# EAGLE board MotorDriver (EAGLE 9.6.2), part 1 of 2
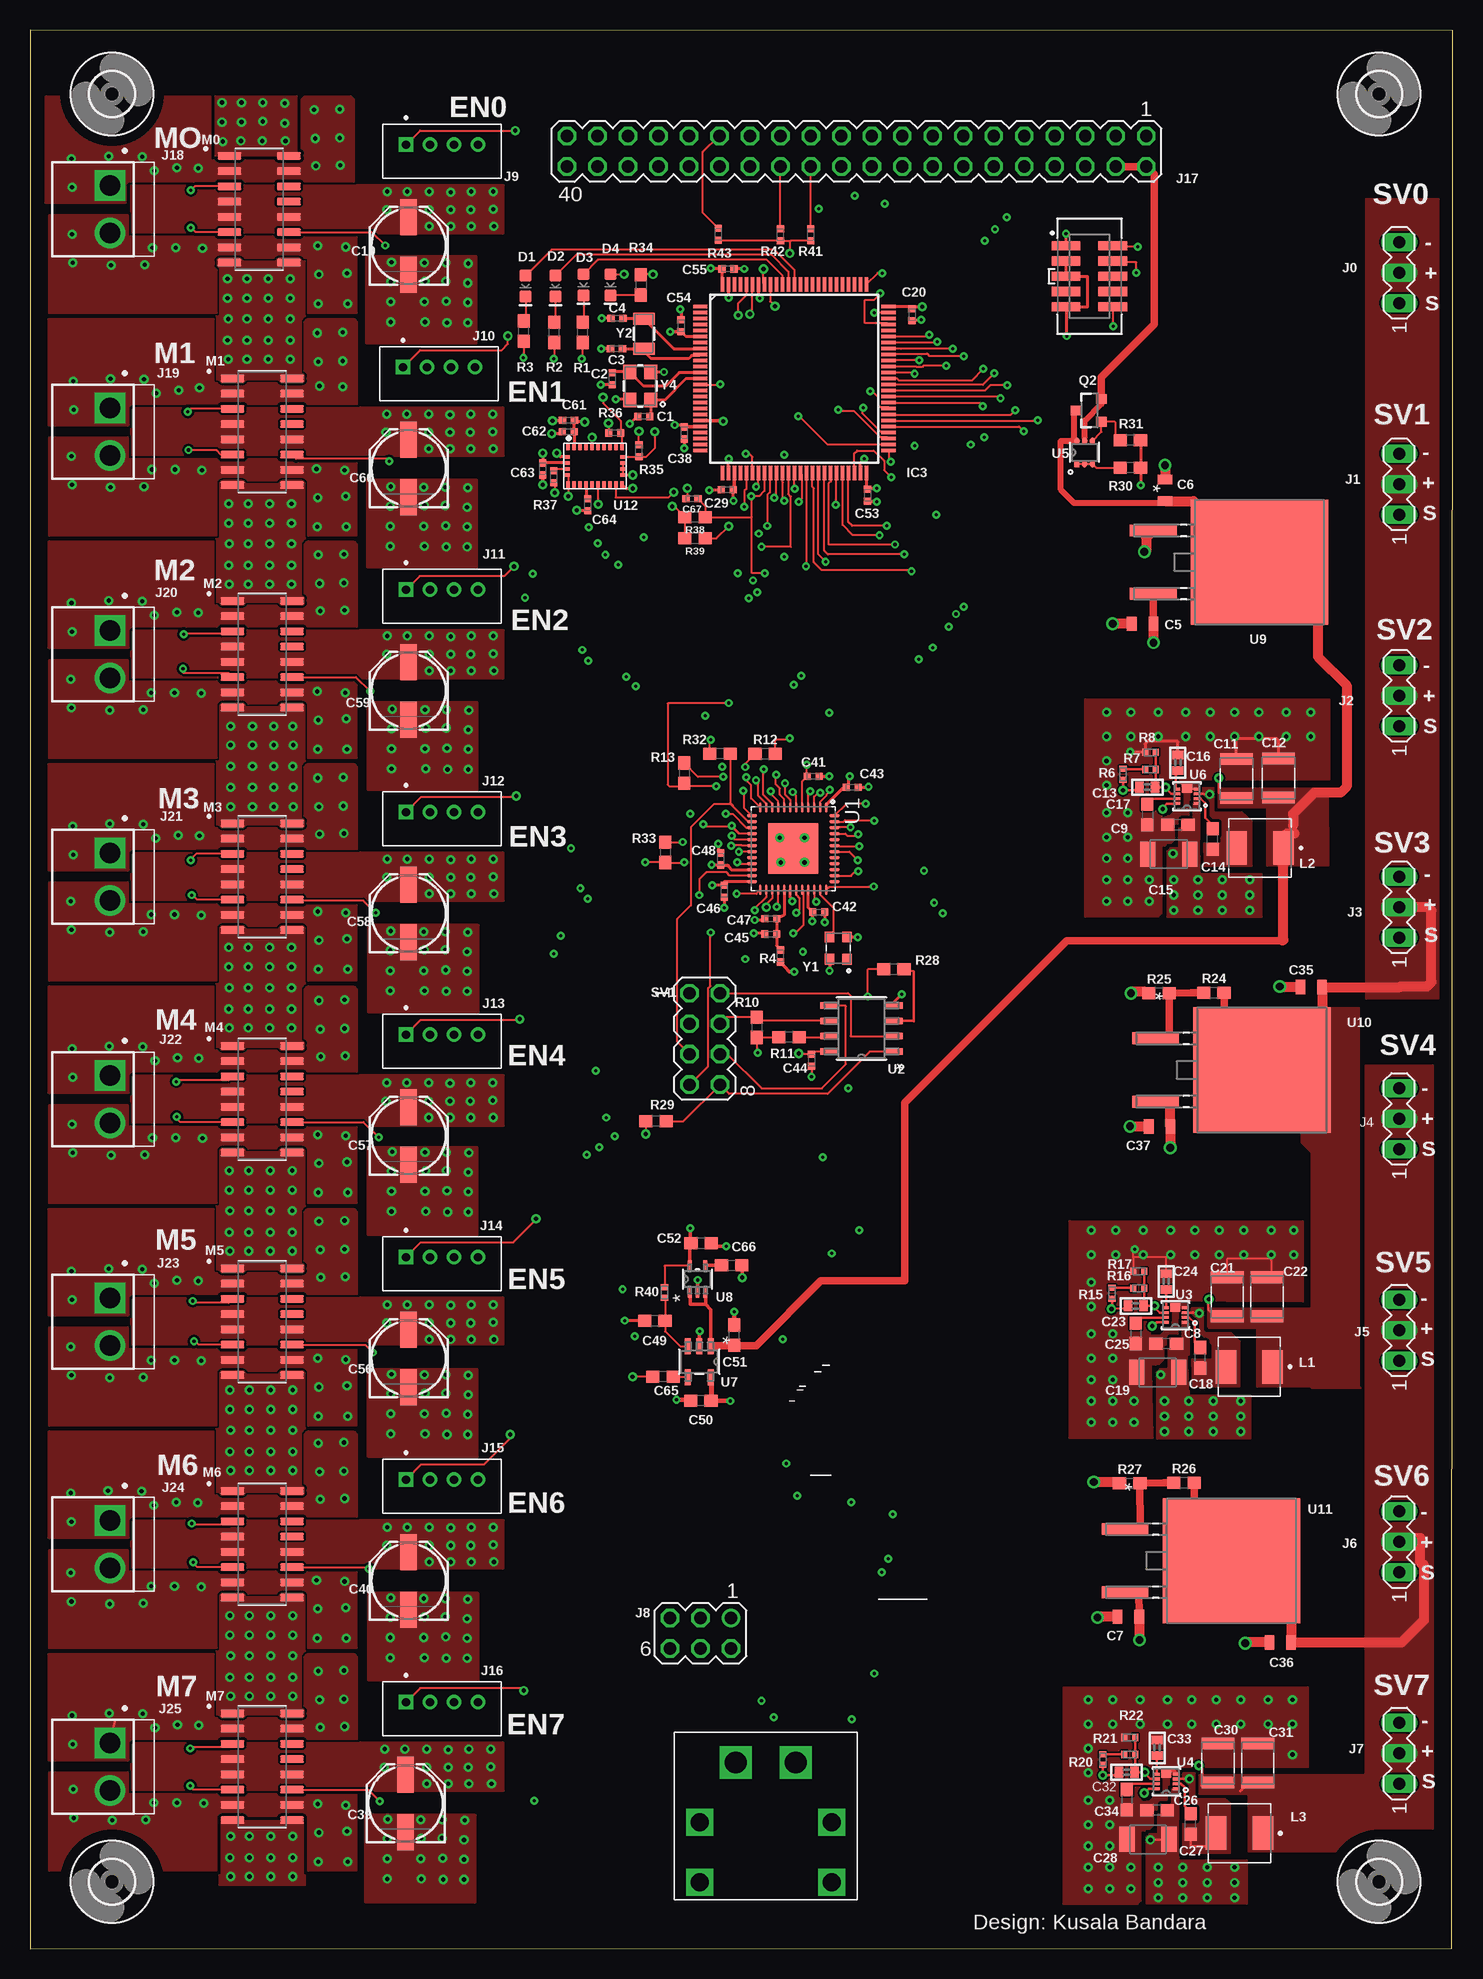
[diagram p5: board, top side]
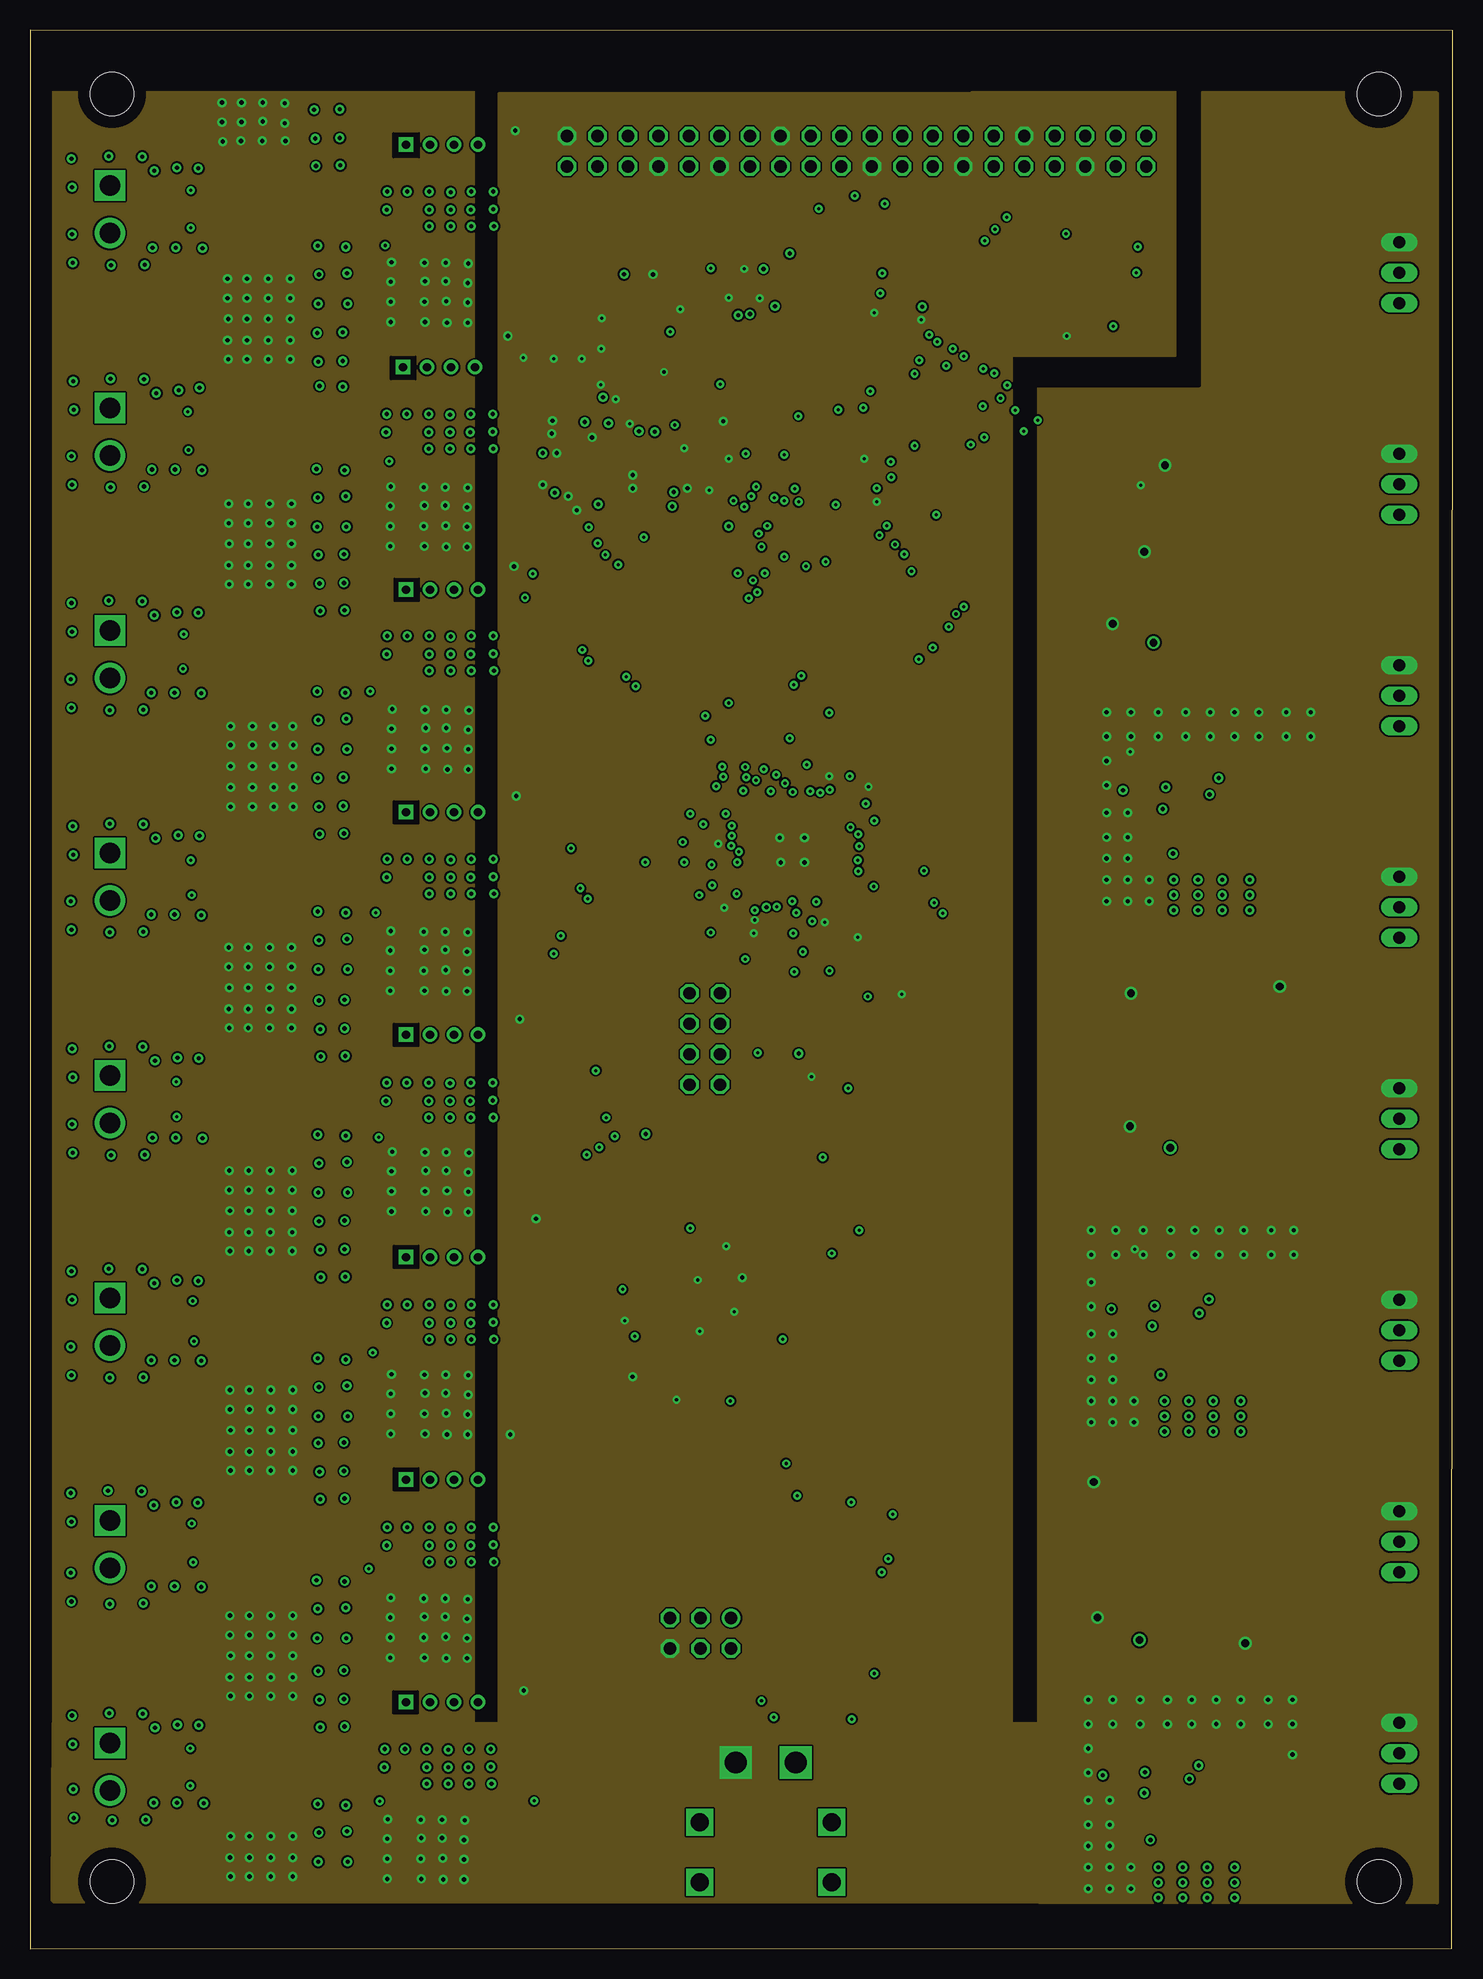
[diagram p6: board, inner layer Route2]
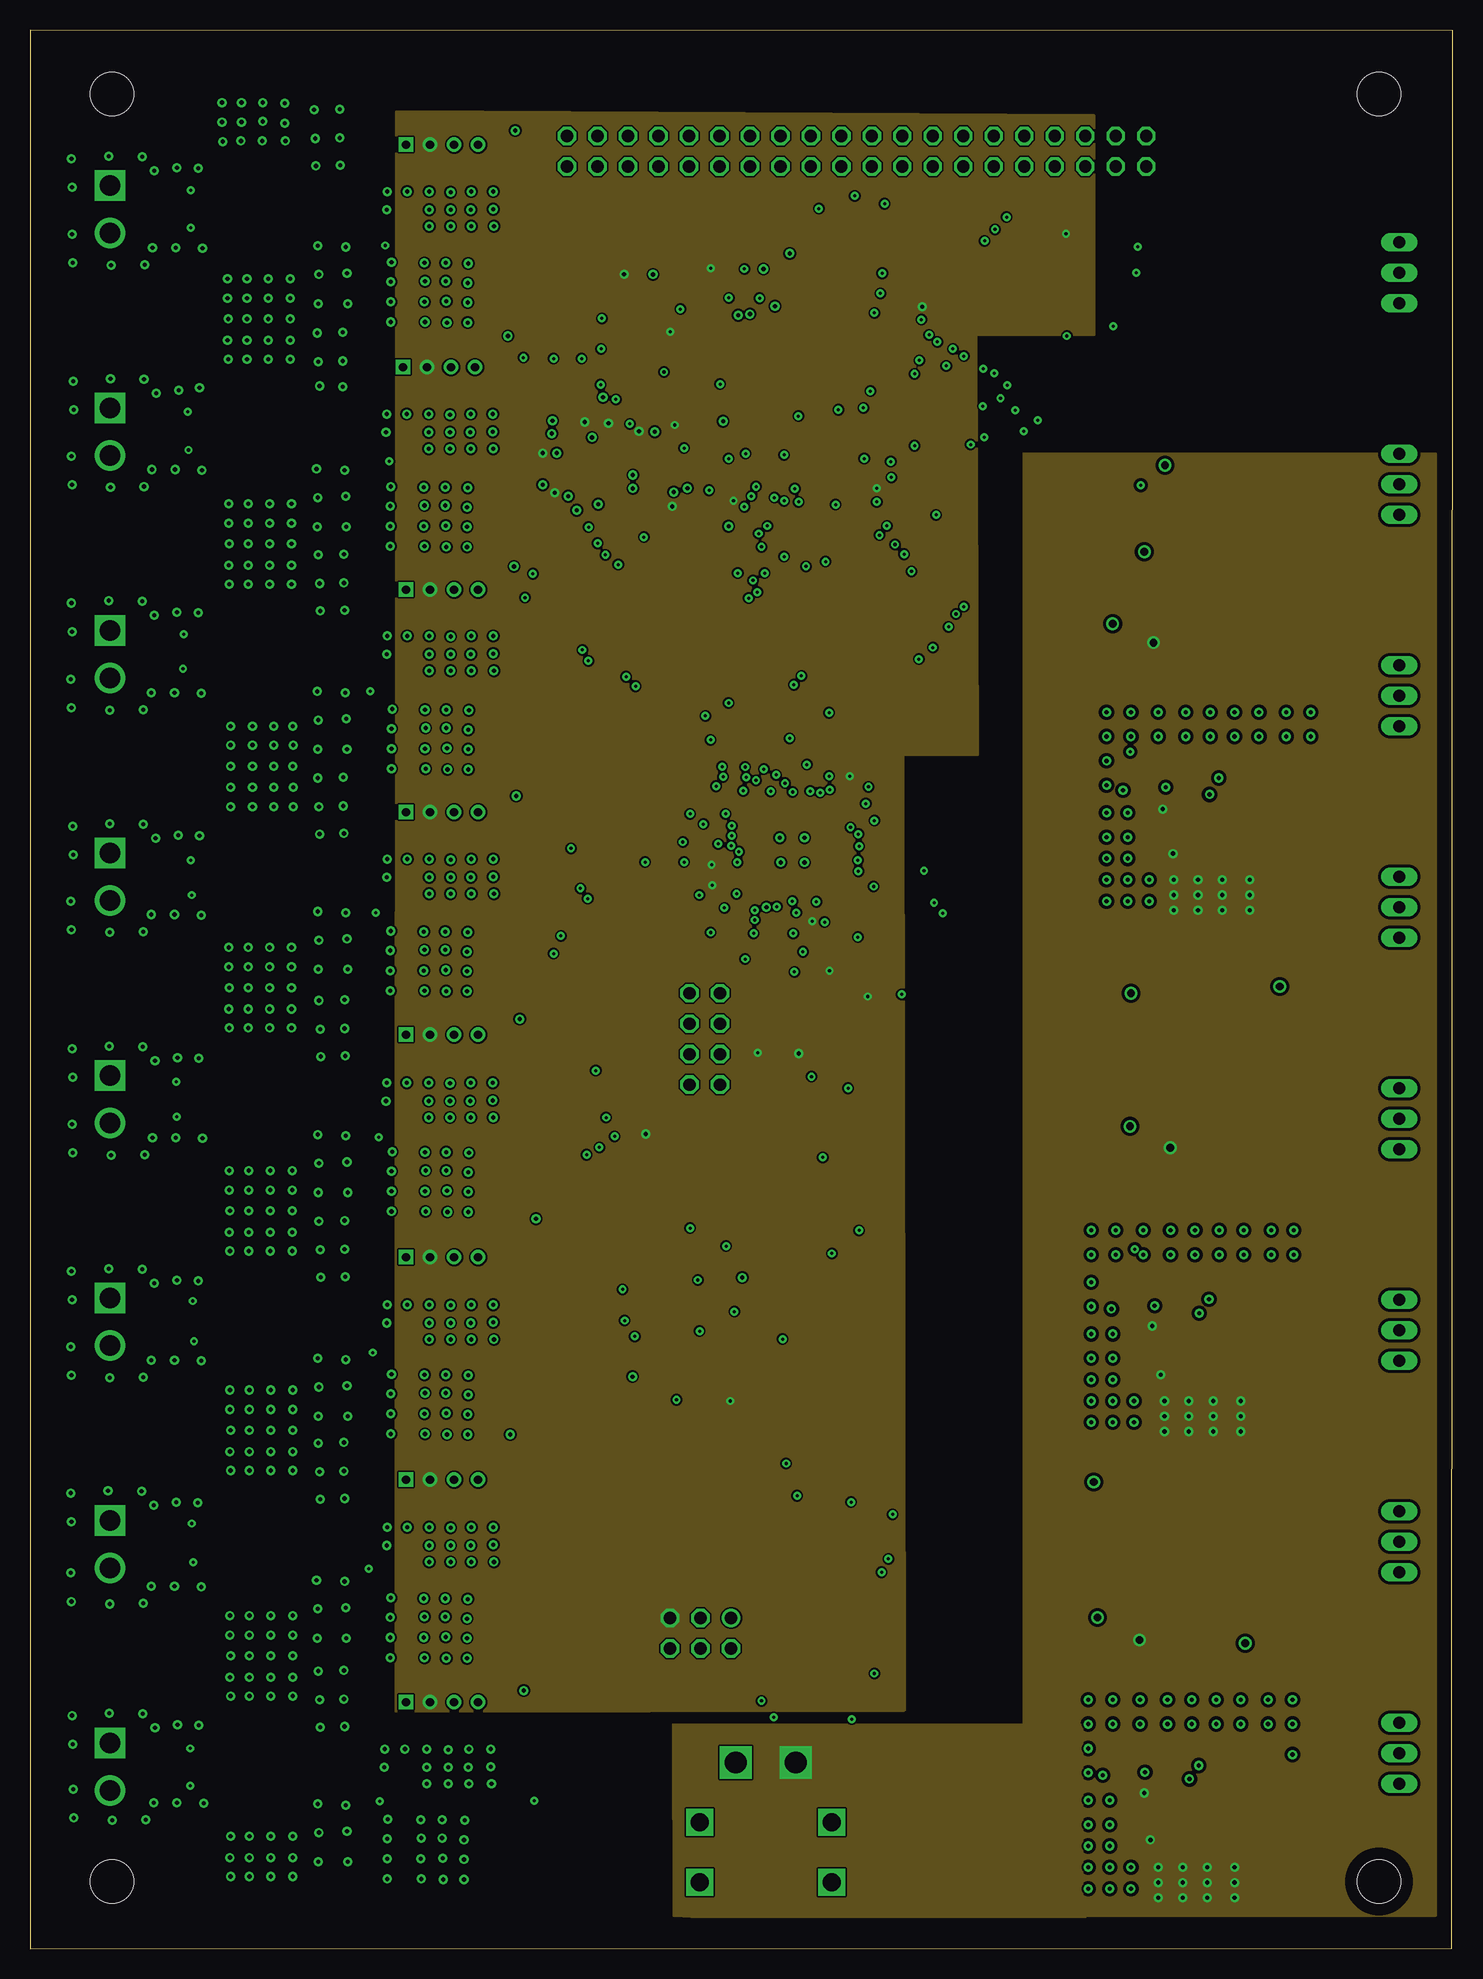
[diagram p7: board, inner layer Route3]
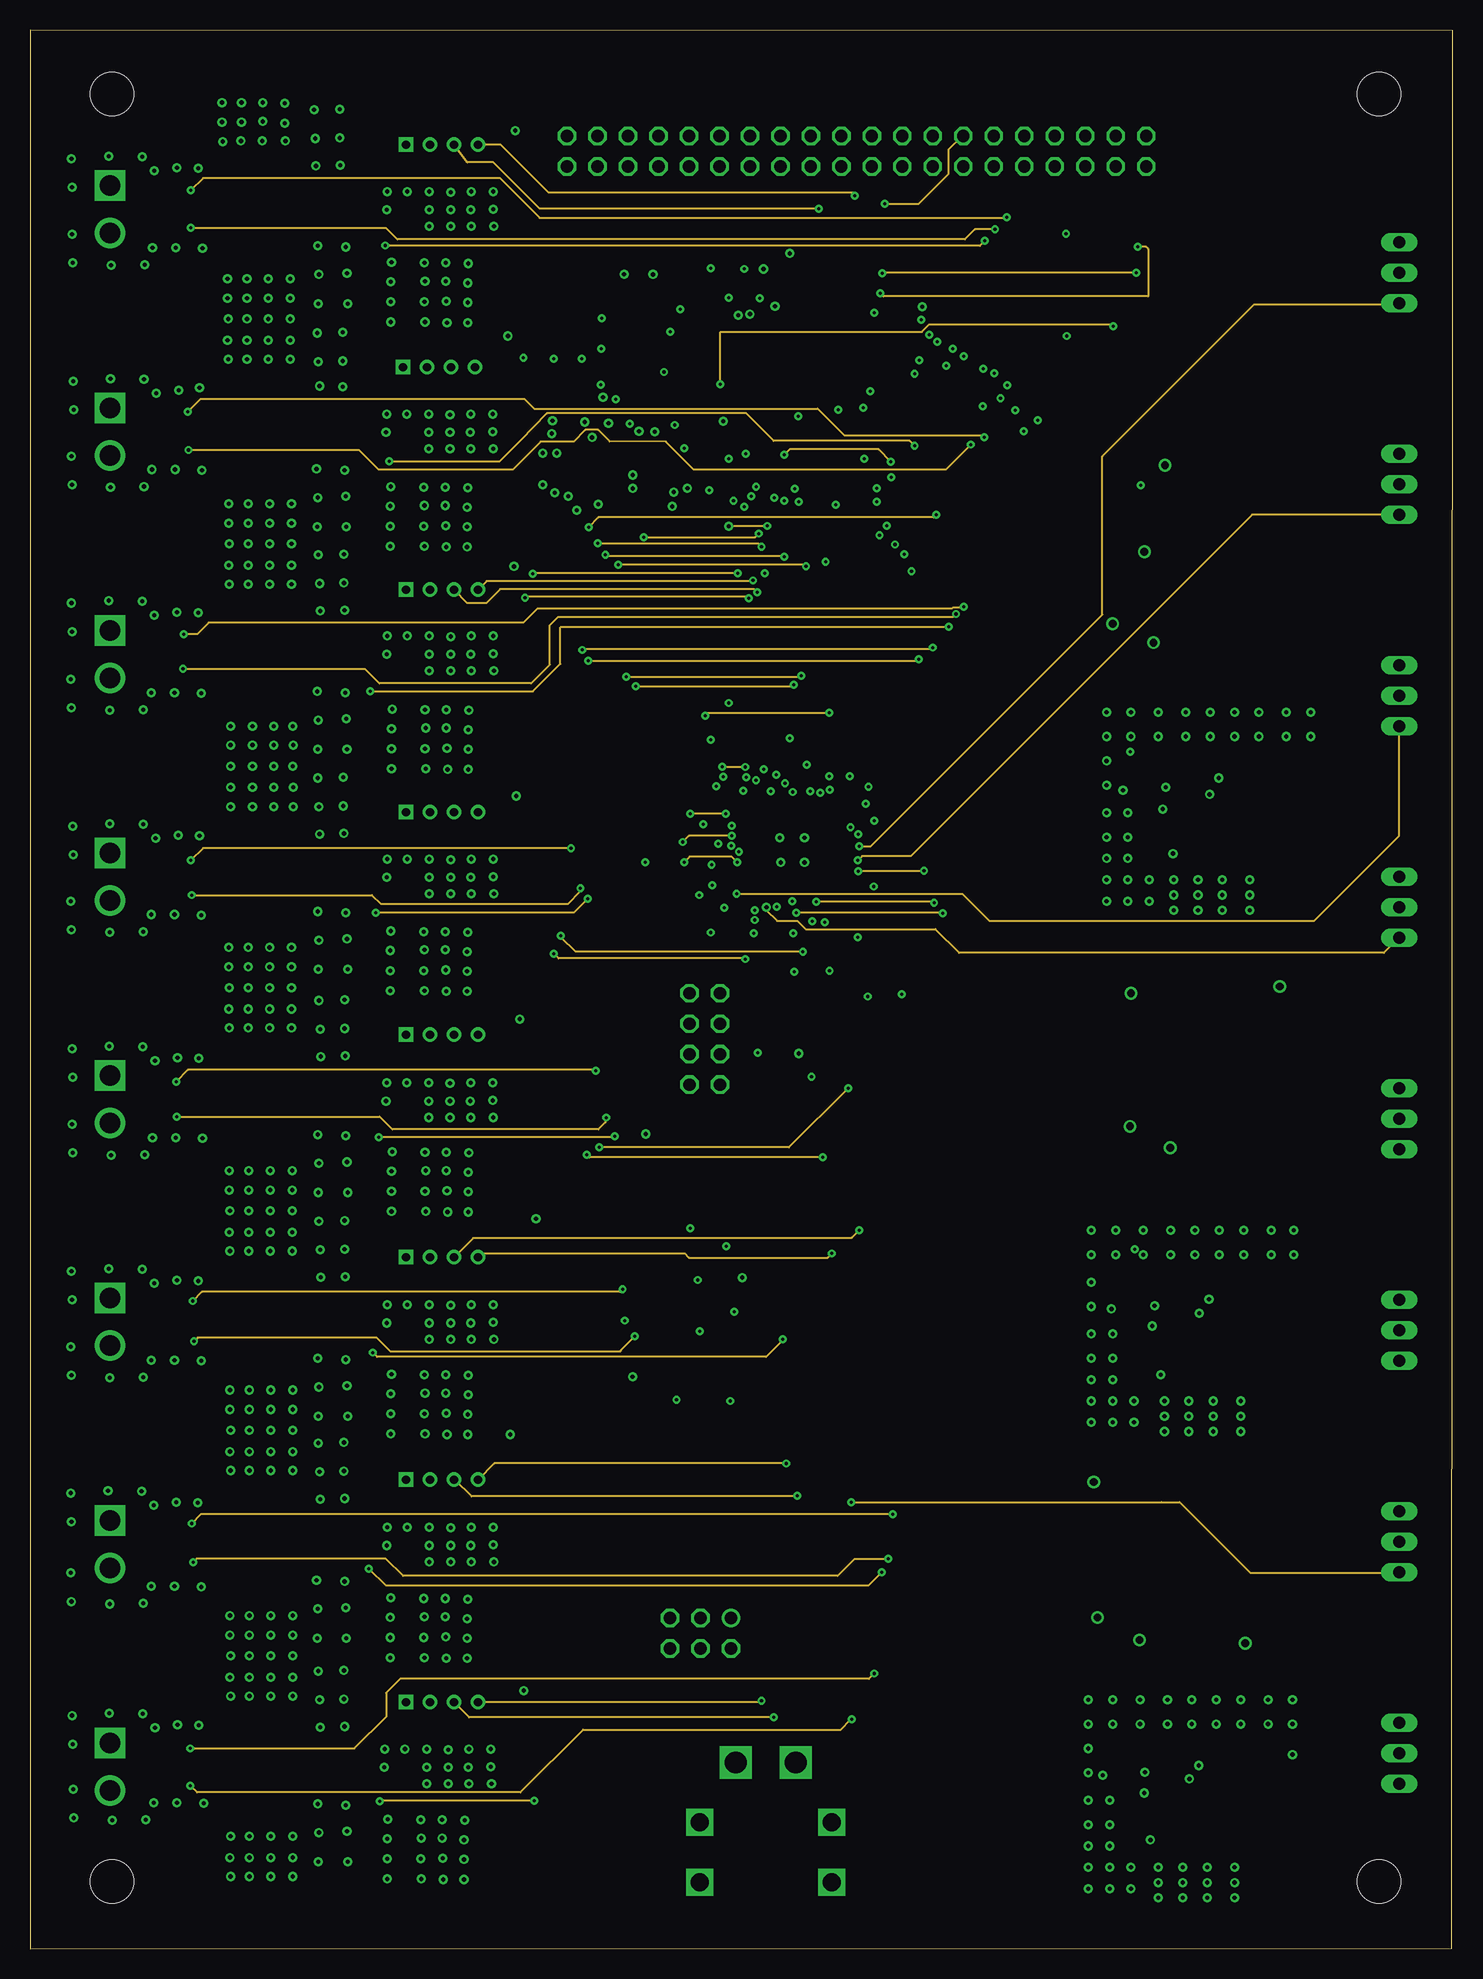
[diagram p8: board, inner layer Route14]
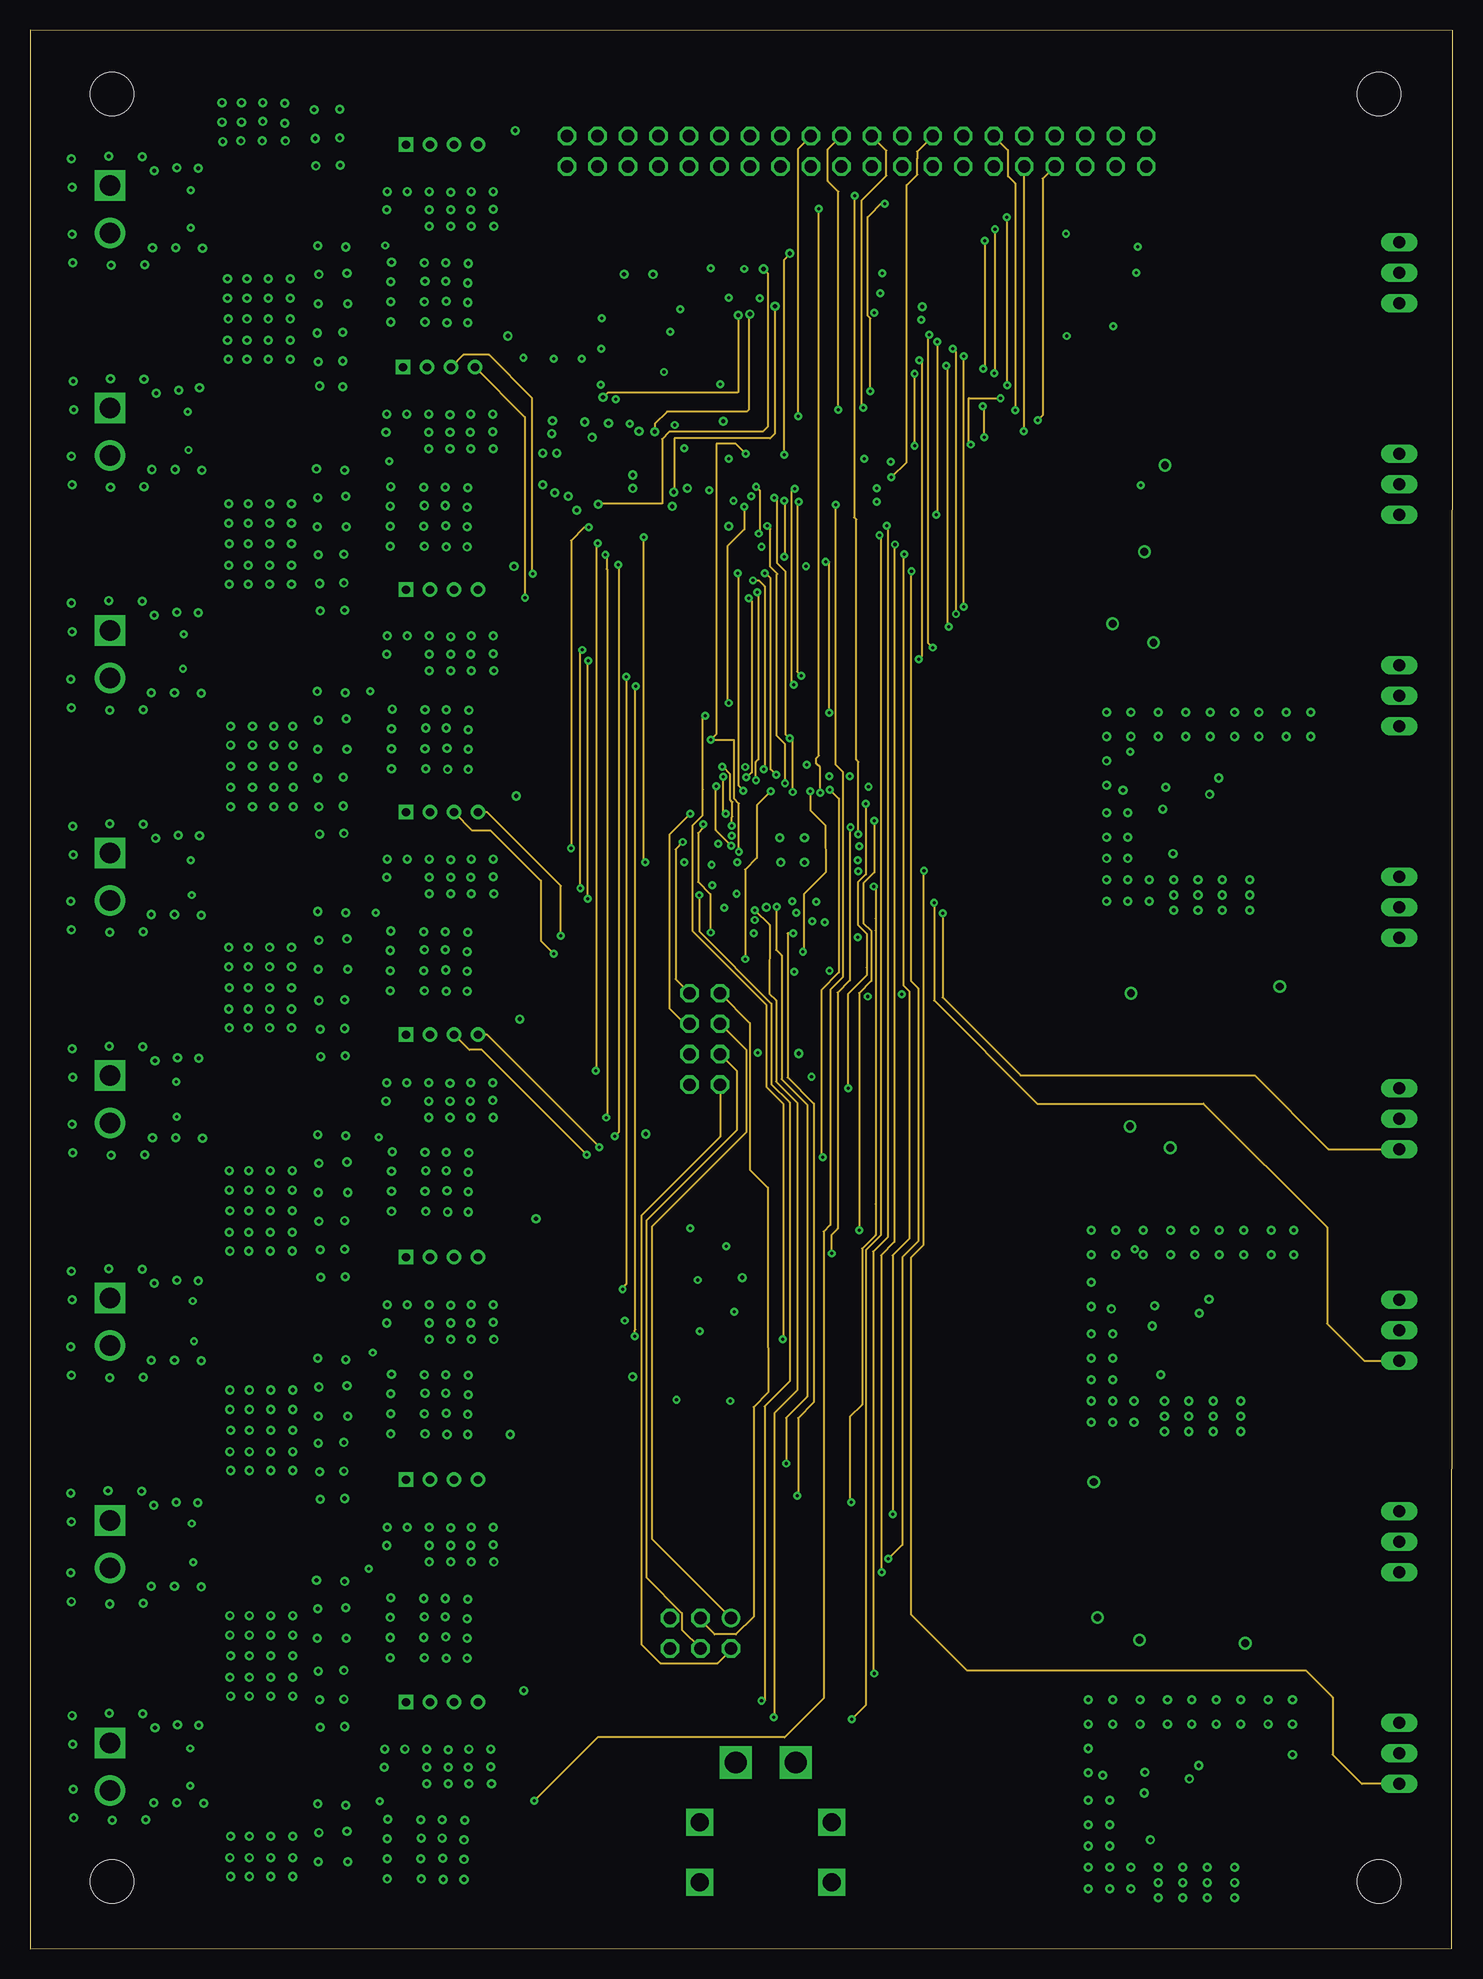
[diagram p9: board, inner layer Route15]
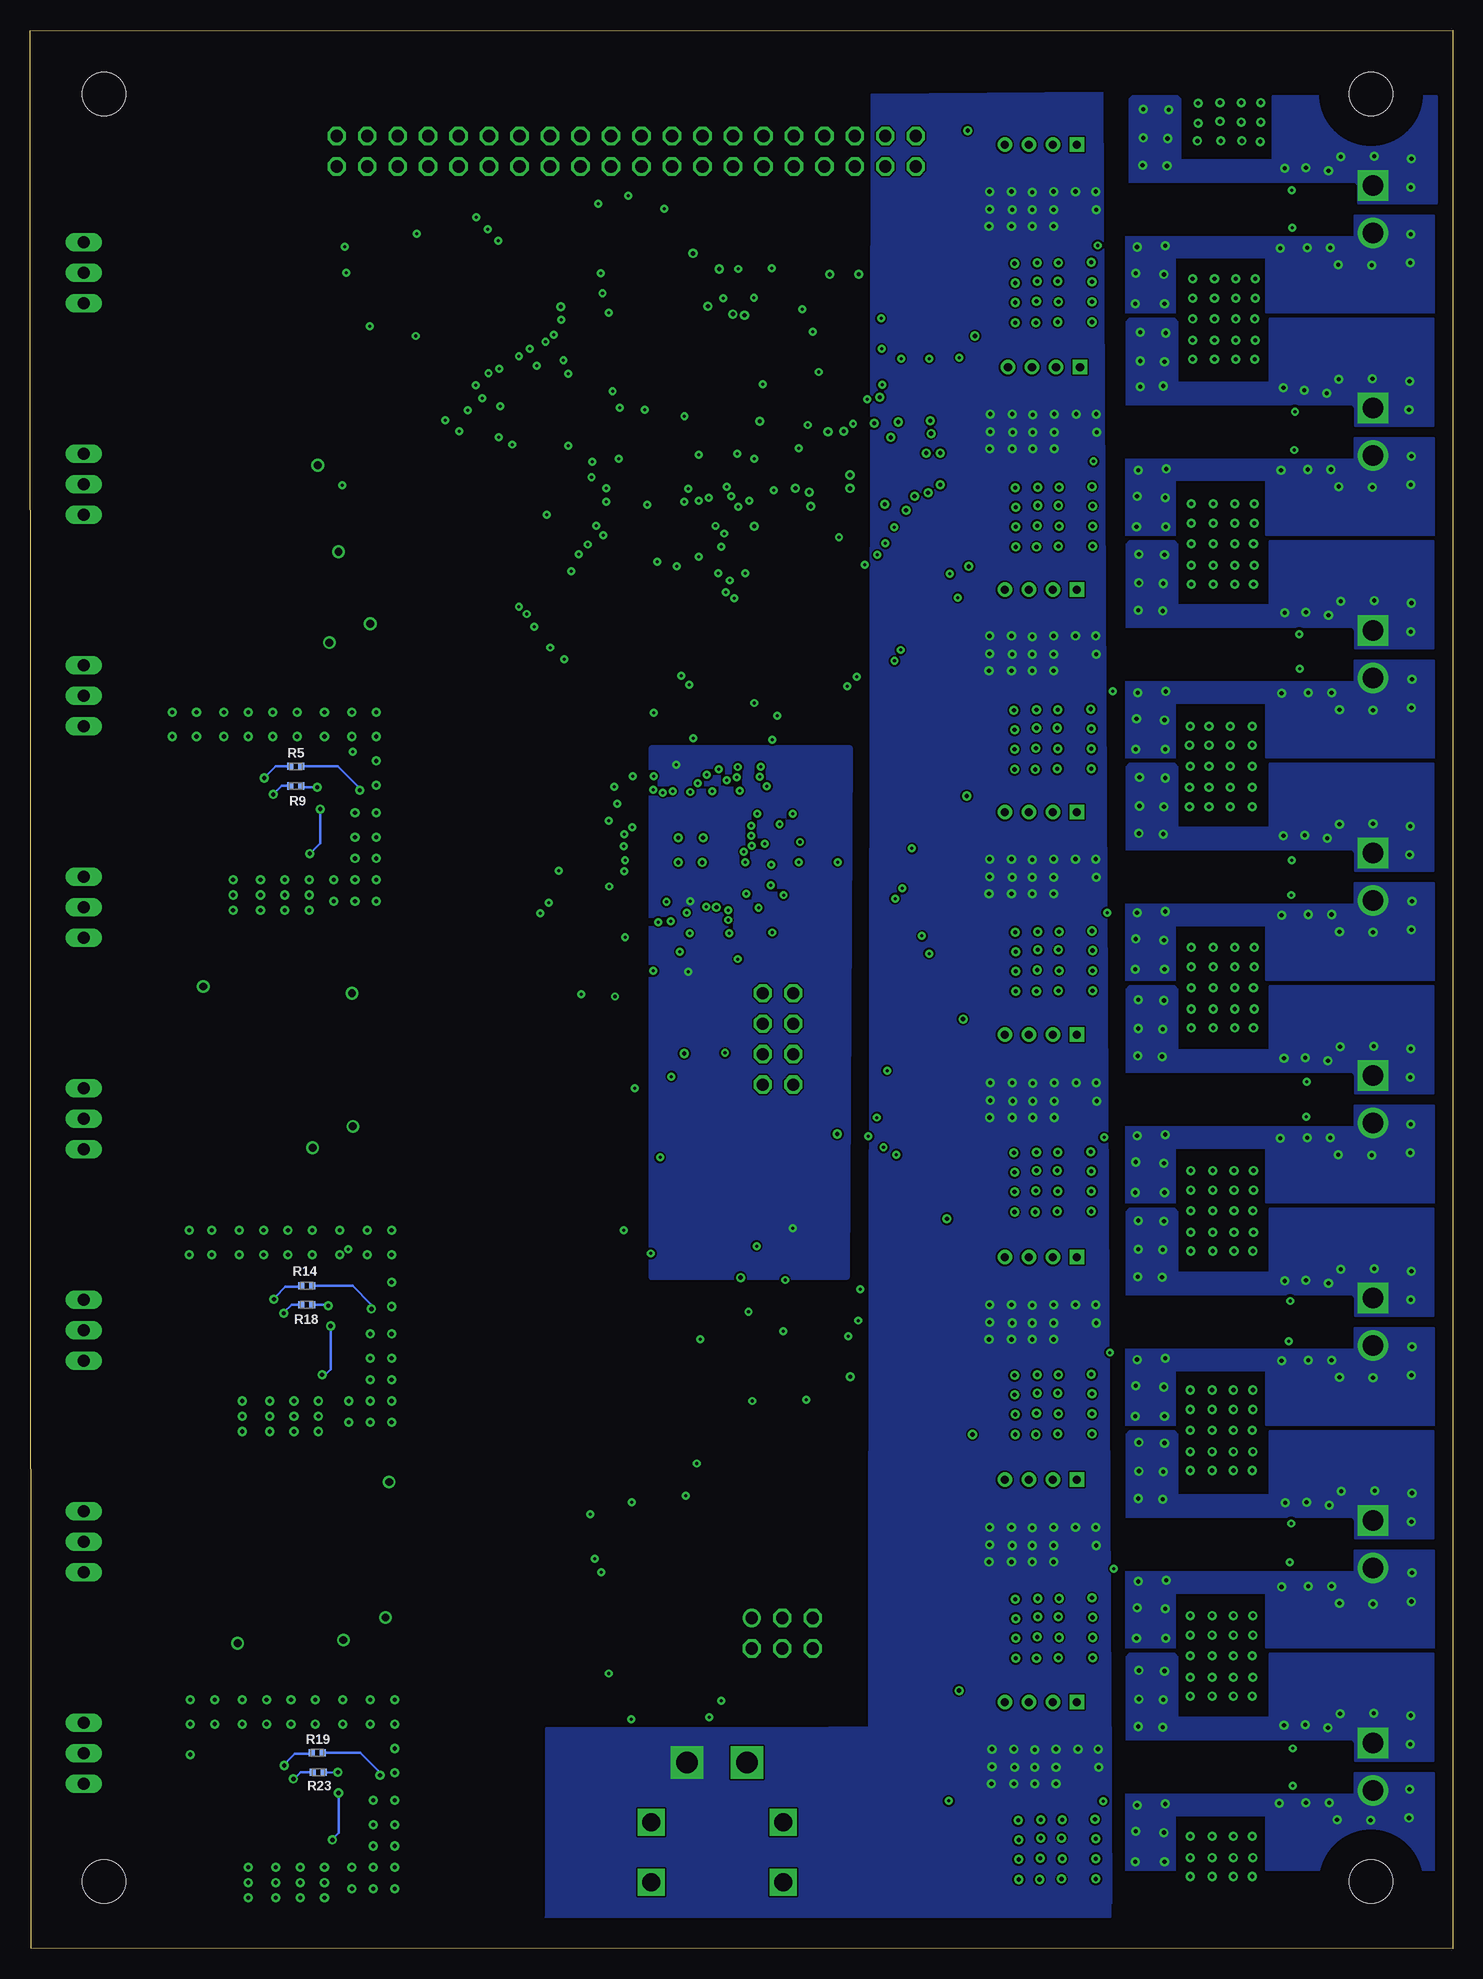
[diagram p10: board, bottom side, seen from below]

Size 118.57 x 159.89 mm. Coordinates in mm from the lower left corner, seen from the top.
Outline: 0,0 118.47,0.03 118.57,159.82 0.03,159.89 0,0
Copper layers (1+2*3+14*15+16): Top 0.035mm / dielectric 1.5mm / Route2 0.035mm / dielectric 0.15mm / Route3 0.035mm / dielectric 0.2mm / Route14 0.035mm / dielectric 0.15mm / Route15 0.035mm / dielectric 0.2mm / Bottom 0.035mm
Design rules "default *": minimum track width 6mil, minimum drill 10mil, track to track 6mil, track to pad 6mil, pad to pad 5mil, via to via 6mil, smd to smd 5mil, copper to edge 40mil, drill to drill 8mil, minimum pad ring 10mil, minimum via ring 8mil, stop-mask expansion 4mil, vias tented up to drill 0mil, thermal gap 10mil

## Footprints (pad centres in the part's own frame; a part is rotated, then mirrored left to right if it is on the bottom)
0402-TIGHT = smd 0.6 x 0.6: 1 -0.5,0; 2 0.5,0
0805 = smd 0.8 x 1.2: 1 -0.9,0; 2 0.9,0
0603 = smd 1.1 x 1: 1 -0.85,0; 2 0.85,0
PANASONIC_D = smd 3 x 1.4: + 2.4,0; - -2.4,0
CAPC3225X270N = smd 0.96 x 2.72: 1 -1.625,0; 2 1.625,0
0402 = smd 0.7 x 0.9: 1 -0.65,0; 2 0.65,0
1210 = smd 1.27 x 2.06: 1 -1.755,0; 2 1.755,0
LED-0603 = smd 1 x 1: A -0.877,0; C 0.877,0
3,6 = hole 3.6: 0,0
LQFP100_14X14 = smd 1.2 x 0.3: 1 -7.85,6; 2 -7.85,5.5; 3 -7.85,5; 4 -7.85,4.5; 5 -7.85,4; 6 -7.85,3.5; 7 -7.85,3; 8 -7.85,2.5; 9 -7.85,2; 10 -7.85,1.5; 11 -7.85,1; 12 -7.85,0.5; 13 -7.85,0; 14 -7.85,-0.5; 15 -7.85,-1; 16 -7.85,-1.5; 17 -7.85,-2; 18 -7.85,-2.5; 19 -7.85,-3; 20 -7.85,-3.5; 21 -7.85,-4; 22 -7.85,-4.5; 23 -7.85,-5; 24 -7.85,-5.5; 25 -7.85,-6; 51 7.85,-6; 52 7.85,-5.5; 53 7.85,-5; 54 7.85,-4.5; 55 7.85,-4; 56 7.85,-3.5; 57 7.85,-3; 58 7.85,-2.5; 59 7.85,-2; 60 7.85,-1.5; 61 7.85,-1; 62 7.85,-0.5; 63 7.85,0; 64 7.85,0.5; 65 7.85,1; 66 7.85,1.5; 67 7.85,2; 68 7.85,2.5; 69 7.85,3; 70 7.85,3.5; 71 7.85,4; 72 7.85,4.5; 73 7.85,5; 74 7.85,5.5; 75 7.85,6 | smd 0.3 x 1.2: 26 -6,-7.85; 27 -5.5,-7.85; 28 -5,-7.85; 29 -4.5,-7.85; 30 -4,-7.85; 31 -3.5,-7.85; 32 -3,-7.85; 33 -2.5,-7.85; 34 -2,-7.85; 35 -1.5,-7.85; 36 -1,-7.85; 37 -0.5,-7.85; 38 0,-7.85; 39 0.5,-7.85; 40 1,-7.85; 41 1.5,-7.85; 42 2,-7.85; 43 2.5,-7.85; 44 3,-7.85; 45 3.5,-7.85; 46 4,-7.85; 47 4.5,-7.85; 48 5,-7.85; 49 5.5,-7.85; 50 6,-7.85; 76 6,7.85; 77 5.5,7.85; 78 5,7.85; 79 4.5,7.85; 80 4,7.85; 81 3.5,7.85; 82 3,7.85; 83 2.5,7.85; 84 2,7.85; 85 1.5,7.85; 86 1,7.85; 87 0.5,7.85; 88 0,7.85; 89 -0.5,7.85; 90 -1,7.85; 91 -1.5,7.85; 92 -2,7.85; 93 -2.5,7.85; 94 -3,7.85; 95 -3.5,7.85; 96 -4,7.85; 97 -4.5,7.85; 98 -5,7.85; 99 -5.5,7.85; 100 -6,7.85
MA03-1 = drill 1.016 long: 1 -2.54,0; 2 0,0; 3 2.54,0
MA03-2 = drill 1.016: 1 -2.54,-1.27 | drill 1.016 octagon: 2 -2.54,1.27; 3 0,-1.27; 4 0,1.27; 5 2.54,-1.27; 6 2.54,1.27
JST_B4B-PH-K-S(LF)(SN) = drill 0.7 square: 1 3,-0.55 | drill 0.7: 2 1,-0.55; 3 -1,-0.55; 4 -3,-0.55
MA20-2 = drill 1.016 octagon: 1 -24.13,-1.27; 2 -24.13,1.27; 3 -21.59,-1.27; 4 -21.59,1.27; 5 -19.05,-1.27; 6 -19.05,1.27; 7 -16.51,-1.27; 8 -16.51,1.27; 9 -13.97,-1.27; 10 -13.97,1.27; 11 -11.43,-1.27; 12 -11.43,1.27; 13 -8.89,-1.27; 14 -8.89,1.27; 15 -6.35,-1.27; 16 -6.35,1.27; 17 -3.81,-1.27; 18 -3.81,1.27; 19 -1.27,-1.27; 20 -1.27,1.27; 21 1.27,-1.27; 22 1.27,1.27; 23 3.81,-1.27; 24 3.81,1.27; 25 6.35,-1.27; 26 6.35,1.27; 27 8.89,-1.27; 28 8.89,1.27; 29 11.43,-1.27; 30 11.43,1.27; 31 13.97,-1.27; 32 13.97,1.27; 33 16.51,-1.27; 34 16.51,1.27; 35 19.05,-1.27; 36 19.05,1.27; 37 21.59,-1.27; 38 21.59,1.27; 39 24.13,-1.27; 40 24.13,1.27
JST_B2P-VH(LF)(SN) = drill 1.7 square: 1 -1.98,0 | drill 1.7: 2 1.98,0
XT30PW = drill 1.8 square: 1 -2.5,0; 2 2.5,0 | drill 1.5 square: P$3 -5.5,5; P$4 5.5,5; P$5 5.5,10; P$6 -5.5,10
2X5-SMD-1.27MM = smd 0.76 x 2.4: 1 2.54,1.95; 2 2.54,-1.95; 3 1.27,1.95; 4 1.27,-1.95; 5 0,1.95; 6 0,-1.95; 7 -1.27,1.95; 8 -1.27,-1.95; 9 -2.54,1.95; 10 -2.54,-1.95
IND_FDSD0518-H-3R3M=P3 = smd 1.7 x 2.8: 1 -1.95,0; 2 1.95,0
SOIC127P600X175-16N = smd 1.97 x 0.6: 1 -2.475,4.445; 2 -2.475,3.175; 3 -2.475,1.905; 4 -2.475,0.635; 5 -2.475,-0.635; 6 -2.475,-1.905; 7 -2.475,-3.175; 8 -2.475,-4.445; 9 2.475,-4.445; 10 2.475,-3.175; 11 2.475,-1.905; 12 2.475,-0.635; 13 2.475,0.635; 14 2.475,1.905; 15 2.475,3.175; 16 2.475,4.445
SOT23-3 = smd 0.8 x 0.9: 1 -0.95,-1; 2 0.95,-1; 3 0,1.1
RESC1005X40N = smd 0.5 x 0.6: 1 -0.452,0; 2 0.452,0
MA04-2 = drill 1.016 octagon: 1 -3.81,-1.27; 2 -3.81,1.27; 3 -1.27,-1.27; 4 -1.27,1.27; 5 1.27,-1.27; 6 1.27,1.27; 7 3.81,-1.27; 8 3.81,1.27
QFN50P700X700X100-49N = smd 0.84 x 0.26: 1 -3.435,2.75; 2 -3.435,2.25; 3 -3.435,1.75; 4 -3.435,1.25; 5 -3.435,0.75; 6 -3.435,0.25; 7 -3.435,-0.25; 8 -3.435,-0.75; 9 -3.435,-1.25; 10 -3.435,-1.75; 11 -3.435,-2.25; 12 -3.435,-2.75; 25 3.435,-2.75; 26 3.435,-2.25; 27 3.435,-1.75; 28 3.435,-1.25; 29 3.435,-0.75; 30 3.435,-0.25; 31 3.435,0.25; 32 3.435,0.75; 33 3.435,1.25; 34 3.435,1.75; 35 3.435,2.25; 36 3.435,2.75 | smd 0.26 x 0.84: 13 -2.75,-3.435; 14 -2.25,-3.435; 15 -1.75,-3.435; 16 -1.25,-3.435; 17 -0.75,-3.435; 18 -0.25,-3.435; 19 0.25,-3.435; 20 0.75,-3.435; 21 1.25,-3.435; 22 1.75,-3.435; 23 2.25,-3.435; 24 2.75,-3.435; 37 2.75,3.435; 38 2.25,3.435; 39 1.75,3.435; 40 1.25,3.435; 41 0.75,3.435; 42 0.25,3.435; 43 -0.25,3.435; 44 -0.75,3.435; 45 -1.25,3.435; 46 -1.75,3.435; 47 -2.25,3.435; 48 -2.75,3.435 | smd 4.2 x 4.2: 49 0,0
SO8N_5X4_MRN = smd 1.499 x 0.533: 1 -2.705,1.905; 2 -2.705,0.635; 3 -2.705,-0.635; 4 -2.705,-1.905; 5 2.705,-1.905; 6 2.705,-0.635; 7 2.705,0.635; 8 2.705,1.905
UMMP008Z2020_ROM = smd 0.457 x 0.254: 1 -0.775,0.6; 2 -0.775,0.2; 3 -0.775,-0.2; 4 -0.775,-0.6; 5 0.775,-0.6; 6 0.775,-0.2; 7 0.775,0.2; 8 0.775,0.6 | smd 0.838 x 0.711: 9 0,-0.648
SOT-363_DIO = smd 0.6 x 0.42: 1 -0.95,0.65; 2 -0.95,0; 3 -0.95,-0.65; 4 0.95,-0.65; 5 0.95,0; 6 0.95,0.65
SOT-23-5_MC_MCH = smd 1.321 x 0.508: 1 -1.295,0.95; 2 -1.295,0; 3 -1.295,-0.95; 4 1.295,-0.95; 5 1.295,0.95
SC-70_C5_MCH = smd 0.876 x 0.305: 1 -1.111,0.65; 2 -1.111,0; 3 -1.111,-0.65; 4 1.111,-0.65; 5 1.111,0.65
D2PAK_STM = smd 0.991 x 3.912: 1 -2.64,-8.877; 3 2.64,-8.877 | smd 10.439 x 11.455: 2 0,0
LGA28R50P4X10_380X520X100 = smd 0.3 x 0.525: 1 -2.25,1.562; 6 -2.25,-1.562; 7 -1.75,-1.562; 8 -1.25,-1.562; 9 -0.75,-1.562; 10 -0.25,-1.562; 11 0.25,-1.562; 12 0.75,-1.562; 13 1.25,-1.562; 14 1.75,-1.562; 15 2.25,-1.562; 20 2.25,1.562; 21 1.75,1.562; 22 1.25,1.562; 23 0.75,1.562; 24 0.25,1.562; 25 -0.25,1.562; 26 -0.75,1.562; 27 -1.25,1.562; 28 -1.75,1.562 | smd 0.425 x 0.3: 2 -2.312,0.75; 3 -2.312,0.25; 4 -2.312,-0.25; 5 -2.312,-0.75; 16 2.312,-0.75; 17 2.312,-0.25; 18 2.312,0.25; 19 2.312,0.75
OSC_ECS-TXO-2520-33-160-AN-TR = smd 0.9 x 0.8: 1 -0.925,-0.725; 2 0.925,-0.725; 3 0.925,0.725; 4 -0.925,0.725
CRYSTAL-SMD-3.2X1.5MM = smd 1 x 1.8: P$1 -1.25,0; P$2 1.25,0
CRYSTAL-SMD-3.2X2.5MM = smd 1.2 x 1.1: 1 -1.175,-0.875; 2 1.175,-0.875; 3 1.175,0.875; 4 -1.175,0.875

## Placement (x,y rotation side)
C1  1.0uF  [0402-TIGHT]  51.16,127.69 180 top
C2  1.0uF  [0402-TIGHT]  48.51,130.84 270 top
C3  1.0uF  [0402-TIGHT]  48.87,133.32 180 top
C4  1.0uF  [0402-TIGHT]  48.92,135.86 180 top
C5  10uF  [0805]  92.71,110.41 180 top
C6  10uF  [0805]  94.59,121.54 90 top
C7  10uF  [0805]  91.54,27.66 180 top
C8  0.1uF  [0603]  94.69,50.42 180 top
C9  0.1uF  [0603]  95.66,93.65 180 top
C10  100uF  [PANASONIC_D]  31.55,141.91 90 top
C11  GRM32ER61E226KE15L  [CAPC3225X270N]  100.53,97.51 90 top
C12  GRM32ER61E226KE15L  [CAPC3225X270N]  104.04,97.56 90 top
C13  GRM1552C1E220JA01-22pf  [0402]  93.12,96.8 0 top
C14  0.1uF  [0603]  98.55,92.48 90 top
C15  20uF  [1210]  94.89,91.21 180 top
C16  GRM155B11H332KA01J-3300pf  [0402]  95.66,98.83 90 top
C17  1.0uF  [0603]  93.12,94.51 270 top
C18  0.1uF  [0603]  97.54,49.25 90 top
C19  20uF  [1210]  93.98,48.03 180 top
C20  1.0uF  [0402-TIGHT]  73.51,136.17 90 top
C21  GRM32ER61E226KE15L  [CAPC3225X270N]  99.77,54.33 90 top
C22  GRM32ER61E226KE15L  [CAPC3225X270N]  103.07,54.33 90 top
C23  GRM1552C1E220JA01-22pf  [0402]  92.15,53.57 0 top
C24  GRM155B11H332KA01J-3300pf  [0402]  94.69,55.6 90 top
C25  1.0uF  [0603]  92.15,51.28 270 top
C26  0.1uF  [0603]  93.93,11.56 180 top
C27  0.1uF  [0603]  96.72,10.39 90 top
C28  20uF  [1210]  93.17,9.12 180 top
C29  1.0uF  [0402-TIGHT]  58.12,121.59 0 top
C30  GRM32ER61E226KE15L  [CAPC3225X270N]  99.01,15.47 90 top
C31  GRM32ER61E226KE15L  [CAPC3225X270N]  102.31,15.47 90 top
C32  GRM1552C1E220JA01-22pf  [0402]  91.39,14.71 0 top
C33  GRM155B11H332KA01J-3300pf  [0402]  93.93,16.74 90 top
C34  1.0uF  [0603]  91.39,12.42 270 top
C35  10uF  [0805]  106.78,80.14 180 top
C36  10uF  [0805]  104.19,25.53 180 top
C37  10uF  [0805]  94.13,68.5 180 top
C38  1.0uF  [0402-TIGHT]  54.51,126.31 90 top
C39  100uF  [PANASONIC_D]  31.29,12.12 90 top
C40  100uF  [PANASONIC_D]  31.55,30.66 90 top
C41  1.0uF  [0402-TIGHT]  65.28,97.71 0 top
C42  100nF  [0402-TIGHT]  65.74,86.39 0 top
C43  1.0uF  [0402-TIGHT]  68.53,96.8 0 top
C44  1.0uF  [0402-TIGHT]  65.13,74.04 270 top
C45  10nF  [0402-TIGHT]  61.72,84.56 180 top
C46  1.0uF  [0402-TIGHT]  57.86,88.11 270 top
C47  100nF  [0402-TIGHT]  61.72,85.83 180 top
C48  1.0uF  [0402-TIGHT]  57.56,90.8 90 top
C49  1.0uF  [0603]  52.07,52.32 180 top
C50  1.0uF  [0603]  55.91,45.67 180 top
C51  1.0uF  [0603]  58.7,51.13 90 top
C52  1.0uF  [0603]  55.93,58.8 0 top
C53  1.0uF  [0402-TIGHT]  69.8,121.13 90 top
C54  1.0uF  [0402-TIGHT]  54.25,135.25 270 top
C55  1.0uF  [0402-TIGHT]  58.17,139.98 0 top
C56  100uF  [PANASONIC_D]  31.55,49.2 90 top
C57  100uF  [PANASONIC_D]  31.55,67.74 90 top
C58  100uF  [PANASONIC_D]  31.55,86.28 90 top
C59  100uF  [PANASONIC_D]  31.55,104.83 90 top
C60  100uF  [PANASONIC_D]  31.55,123.37 90 top
C61  120nF  [0402-TIGHT]  44.88,127.38 0 top
C62  6.8nF  [0402-TIGHT]  44.86,126.42 0 top
C63  100nF  [0402-TIGHT]  42.72,123.32 90 top
C64  100nF  [0402-TIGHT]  46.48,120.32 90 top
C65  1.0uF  [0603]  52.76,47.68 180 top
C66  1.0uF  [0603]  58.47,56.95 0 top
C67  1.0uF  [0402-TIGHT]  55.17,120.83 180 top
D1  [LED-0603]  41.3,138.56 270 top
D2  [LED-0603]  43.79,138.56 270 top
D3  [LED-0603]  46.13,138.66 270 top
D4  [LED-0603]  48.36,138.66 270 top
H1  MOUNT-HOLE3.6  [3,6]  6.83,5.59 0 top
H2  MOUNT-HOLE3.6  [3,6]  112.42,5.59 0 top
H3  MOUNT-HOLE3.6  [3,6]  6.83,154.56 0 top
H4  MOUNT-HOLE3.6  [3,6]  112.42,154.56 0 top
IC3  STM32F071V8T6V8  [LQFP100_14X14]  63.7,130.84 0 top
J0  [MA03-1]  114.1,139.67 90 top
J1  [MA03-1]  114.1,122.05 90 top
J2  [MA03-1]  114.1,104.42 90 top
J3  [MA03-1]  114.1,86.79 90 top
J4  [MA03-1]  114.1,69.16 90 top
J5  [MA03-1]  114.1,51.54 90 top
J6  [MA03-1]  114.1,33.91 90 top
J7  [MA03-1]  114.1,16.28 90 top
J8  [MA03-2]  55.88,26.29 180 top
J9  B4B-PH-K-S(LF)(SN)  [JST_B4B-PH-K-S(LF)(SN)]  34.34,149.78 180 top
J10  B4B-PH-K-S(LF)(SN)  [JST_B4B-PH-K-S(LF)(SN)]  34.09,131.24 180 top
J11  B4B-PH-K-S(LF)(SN)  [JST_B4B-PH-K-S(LF)(SN)]  34.34,112.7 180 top
J12  B4B-PH-K-S(LF)(SN)  [JST_B4B-PH-K-S(LF)(SN)]  34.34,94.16 180 top
J13  B4B-PH-K-S(LF)(SN)  [JST_B4B-PH-K-S(LF)(SN)]  34.34,75.62 180 top
J14  B4B-PH-K-S(LF)(SN)  [JST_B4B-PH-K-S(LF)(SN)]  34.34,57.07 180 top
J15  B4B-PH-K-S(LF)(SN)  [JST_B4B-PH-K-S(LF)(SN)]  34.34,38.53 180 top
J16  B4B-PH-K-S(LF)(SN)  [JST_B4B-PH-K-S(LF)(SN)]  34.34,19.99 180 top
J17  [MA20-2]  68.88,149.78 180 top
J18  B2P-VH(LF)(SN)  [JST_B2P-VH(LF)(SN)]  6.65,144.96 270 top
J19  B2P-VH(LF)(SN)  [JST_B2P-VH(LF)(SN)]  6.65,126.42 270 top
J20  B2P-VH(LF)(SN)  [JST_B2P-VH(LF)(SN)]  6.65,107.87 270 top
J21  B2P-VH(LF)(SN)  [JST_B2P-VH(LF)(SN)]  6.65,89.33 270 top
J22  B2P-VH(LF)(SN)  [JST_B2P-VH(LF)(SN)]  6.65,70.79 270 top
J23  B2P-VH(LF)(SN)  [JST_B2P-VH(LF)(SN)]  6.65,52.25 270 top
J24  B2P-VH(LF)(SN)  [JST_B2P-VH(LF)(SN)]  6.65,33.71 270 top
J25  B2P-VH(LF)(SN)  [JST_B2P-VH(LF)(SN)]  6.65,15.16 270 top
J26  XT30PWXT30PW  [XT30PW]  61.32,15.52 180 top
JTAG  CORTEX_JTAG_DEBUG_SMD  [2X5-SMD-1.27MM]  88.29,139.37 90 top
L1  FDSD0518-H-3R3M=P3  [IND_FDSD0518-H-3R3M=P3]  101.6,48.49 180 top
L2  FDSD0518-H-3R3M=P3  [IND_FDSD0518-H-3R3M=P3]  102.51,91.72 180 top
L3  FDSD0518-H-3R3M=P3  [IND_FDSD0518-H-3R3M=P3]  100.79,9.63 180 top
M0  VNH7100ASTR  [SOIC127P600X175-16N]  19.1,144.96 0 top
M1  VNH7100ASTR  [SOIC127P600X175-16N]  19.35,126.42 0 top
M2  VNH7100ASTR  [SOIC127P600X175-16N]  19.35,107.87 0 top
M3  VNH7100ASTR  [SOIC127P600X175-16N]  19.35,89.33 0 top
M4  VNH7100ASTR  [SOIC127P600X175-16N]  19.35,70.79 0 top
M5  VNH7100ASTR  [SOIC127P600X175-16N]  19.35,52.25 0 top
M6  VNH7100ASTR  [SOIC127P600X175-16N]  19.35,33.71 0 top
M7  VNH7100ASTR  [SOIC127P600X175-16N]  19.35,15.16 0 top
Q2  20V/4.2A/52mΩ/1.4W  [SOT23-3]  88.29,128.19 90 top
R1  330  [0603]  46.08,134.7 90 top
R2  330  [0603]  43.69,134.7 90 top
R3  330  [0603]  41.15,134.8 90 top
R4  100  [0402-TIGHT]  62.53,82.73 270 top
R5  MCR01MZPJ000  [RESC1005X40N]  96.42,98.53 180 bottom
R6  MCR01MZPF1801  [RESC1005X40N]  91.08,97.87 90 top
R7  MCR01MZPF1203  [RESC1005X40N]  93.37,98.27 0 top
R8  MCR01MZPF2202  [RESC1005X40N]  93.37,99.69 0 top
R9  MCR01MZPF1801  [RESC1005X40N]  96.42,96.9 0 bottom
R10  10k  [0603]  60.55,76.78 270 top
R11  10k  [0603]  63.25,75.97 180 top
R12  100  [0603]  61.26,99.59 0 top
R13  100  [0603]  54.51,97.97 270 top
R14  MCR01MZPJ000  [RESC1005X40N]  95.5,55.24 180 bottom
R15  MCR01MZPF1801  [RESC1005X40N]  90.17,54.64 90 top
R16  MCR01MZPF1203  [RESC1005X40N]  92.41,55.04 0 top
R17  MCR01MZPF2202  [RESC1005X40N]  92.41,56.46 0 top
R18  MCR01MZPF1801  [RESC1005X40N]  95.5,53.67 0 bottom
R19  MCR01MZPJ000  [RESC1005X40N]  94.64,16.33 180 bottom
R20  MCR01MZPF1801  [RESC1005X40N]  89.41,15.77 90 top
R21  MCR01MZPF1203  [RESC1005X40N]  91.64,16.18 0 top
R22  MCR01MZPF2202  [RESC1005X40N]  91.64,17.6 0 top
R23  MCR01MZPF1801  [RESC1005X40N]  94.54,14.71 0 bottom
R24  120ohms  [0603]  98.65,79.68 0 top
R25  120ohms  [0603]  94.08,79.63 0 top
R26  120ohms  [0603]  96.16,38.84 0 top
R27  120ohms  [0603]  91.64,38.79 0 top
R28  10k  [0603]  71.98,81.61 180 top
R29  10k  [0603]  52.17,68.96 180 top
R30  10k  [0603]  91.69,123.42 180 top
R31  10k  [0603]  91.69,125.7 180 top
R32  100  [0603]  57.51,99.59 180 top
R33  100  [0603]  52.93,91.36 270 top
R34  330  [0603]  50.9,138.66 270 top
R35  47k  [0402-TIGHT]  50.75,124.84 90 top
R36  47k  [0402-TIGHT]  48.72,126.31 180 top
R37  10k  [0402-TIGHT]  43.64,122.66 90 top
R38  10k  [0603]  55.42,119.3 180 top
R39  10k  [0603]  55.42,117.53 180 top
R40  MCR01MZPF1801  [RESC1005X40N]  52.88,54.69 90 top
R41  47k  [0402-TIGHT]  65.07,142.82 270 top
R42  47k  [0402-TIGHT]  62.53,142.82 270 top
R43  47k  [0402-TIGHT]  57.35,142.88 90 top
SV1  [MA04-2]  56.24,75.82 270 top
U1  ICE5LP1K-SG48ITR  [QFN50P700X700X100-49N]  63.6,91.67 270 top
U2  N25Q032A13ESC40F  [SO8N_5X4_MRN]  69.29,76.68 180 top
U3  BD9D323QWZ-E2  [UMMP008Z2020_ROM]  95.45,52.81 180 top
U4  BD9D323QWZ-E2  [UMMP008Z2020_ROM]  94.69,13.94 180 top
U5  MMDT5401-7-F  [SOT-363_DIO]  87.88,124.69 90 top
U6  BD9D323QWZ-E2  [UMMP008Z2020_ROM]  96.42,96.04 180 top
U7  MIC5504-3.3YM5-TR  [SOT-23-5_MC_MCH]  55.78,48.92 270 top
U8  MIC5365-1.2YC5-TR  [SC-70_C5_MCH]  55.63,55.8 90 top
U9  LD1085D2T33R  [D2PAK_STM]  102.46,115.54 270 top
U10  LD1085D2T33R  [D2PAK_STM]  102.67,73.23 270 top
U11  LD1085D2T33R  [D2PAK_STM]  100.13,32.33 270 top
U12  BNO055  [LGA28R50P4X10_380X520X100]  47.09,123.57 0 top
Y1  ECS-TXO-2520-33-160-AN-TR  [OSC_ECS-TXO-2520-33-160-AN-TR]  67.36,83.39 90 top
Y2  32.768kHz  [CRYSTAL-SMD-3.2X1.5MM]  51.16,134.59 90 top
Y4  CRYSTAL-GROUNDEDSMD-3.2X2.5  [CRYSTAL-SMD-3.2X2.5MM]  50.85,130.23 90 top

## Tracks (layer width: path | path; a pad name or v marks a point on that pad's centre or on a via)
CRYSTAL0_IN
  Top 0.254: IC3.8 53.66,133.34 Y2.P$2 49.47,135.84 C4.1
CRYSTAL0_OUT
  Top 0.254: IC3.9 55.78,132.76 55.14,132.76 54.88,132.51 51.76,132.51 51.16,133.12 | Y2.P$1 51.16,133.12 | C3.1 50.95,133.32 51.16,133.12
CRYSTAL1_IN
  Top 0.254: IC3.12 54.09,131.34 52.98,130.23 51.15,130.23 Y4.3 48.52,131.4 C2.1
CRYSTAL1_OUT
  Top 0.254: IC3.13 54.66,130.84 52.88,129.05 Y4.1 51.73,127.76 C1.1
EN0-A  (via drill 0.25)
  Top 0.152: U1.3 65.35,96.01 65.68,96.34 v65.84,96.34
  Route14 0.152: J9.3 36.45,148.87 38.61,148.87 42.47,145.01 v65.73,145.01
  Route15 0.152: v65.84,96.34 65.84,98.45 65.53,98.75 65.53,99.21 65.73,99.42 v65.73,145.01
EN0-B  (via drill 0.25)
  Top 0.152: U1.45 67.95,92.92 68.15,92.72 68.86,92.72 v69.04,92.89
  Route14 0.152: v68.73,146.08 68.73,146.34 43.22,146.34 39.22,150.33 J9.4
  Route15 0.152: v68.73,146.08 68.68,146.02 68.68,119.28 68.86,119.1 68.86,99.08 69.04,98.9 v69.04,92.89
EN1-A  (via drill 0.25)
  Top 0.152: U1.13 59.49,95.1 59.49,96.44 v59.44,96.49
  Route14 0.152: v58.98,114.63 41.96,114.63 v41.91,114.58
  Route15 0.152: v58.98,114.63 59.03,114.58 59.03,96.95 59.44,96.55 v59.44,96.49 | v41.91,114.58 41.81,114.68 41.81,129.26 38.25,132.82 36.11,132.82 J10.3
EN1-B  (via drill 0.25)
  Top 0.152: U1.12 60.1,95.86 60.1,96.97 59.69,97.38 v59.69,97.61
  Route14 0.152: v59.89,112.55 59.79,112.65 41.3,112.65 v41.25,112.6
  Route15 0.152: v59.69,97.61 59.74,97.61 60.15,98.02 60.15,112.29 v59.89,112.55 | v41.25,112.6 41.25,127.63 J10.4
EN2-A  (via drill 0.25)
  Top 0.152: U1.11 61.36,95.11 61.36,95.41 60.71,96.07 60.71,97.15 v60.5,97.36
  Route14 0.152: v60.6,113.06 60.35,113.31 39.18,113.31 38.01,112.14 36.45,112.14 J11.3
  Route15 0.152: v60.6,113.06 60.71,112.95 60.71,99.11 60.5,98.91 v60.5,97.36
EN2-B  (via drill 0.25)
  Top 0.152: U1.10 61.86,95.11 61.86,95.41 61.24,96.04 61.11,96.16 61.11,98.25 v61.16,98.3
  Route14 0.152: v60.25,114.02 60.2,113.97 38.06,113.97 J11.4
  Route15 0.152: v61.16,98.3 61.21,98.35 61.21,113.53 60.72,114.02 v60.25,114.02
EN3-A  (via drill 0.25)
  Top 0.152: v61.72,96.45 61.72,96.24 62.35,95.61 U1.9
  Route14 0.152: v59.59,82.47 59.54,82.52 44.04,82.52 v43.64,82.93
  Route15 0.152: v61.72,96.45 60.58,95.3 60.58,90.91 59.59,89.92 v59.59,82.47 | J12.3 36.86,93.18 38.39,93.18 42.57,89 42.57,84 v43.64,82.93
EN3-B  (via drill 0.25)
  Top 0.152: U1.4 64.85,96.32 65.02,96.49 v65.02,96.47
  Route14 0.152: v44.25,84.4 44.25,84.3 45.47,83.08 v64.41,83.08
  Route15 0.152: v65.02,96.47 65.02,94.87 66.28,93.61 66.31,89.7 64.49,87.88 64.49,83.16 v64.41,83.08 | v44.25,84.4 44.25,88.56 38.1,94.71 J12.4
EN4-A  (via drill 0.25)
  Top 0.152: U1.2 65.85,95.57 66.4,96.11 66.4,96.19 66.65,96.44 v66.65,96.6
  Route14 0.152: v66.07,65.94 46.61,65.94 v46.38,66.17
  Route15 0.152: v66.65,96.6 67.41,95.83 67.41,81.36 65.94,79.88 65.94,66.07 v66.07,65.94 | v46.38,66.17 37.65,74.9 36.61,74.9 J13.3
EN4-B  (via drill 0.25)
  Top 0.152: v69.65,95.43 68.05,95.43 U1.48
  Route14 0.152: v68.17,71.7 63.25,66.78 v47.45,66.78
  Route15 0.152: v69.65,95.43 69.65,89.53 68.99,88.87 68.99,85.32 69.71,84.59 69.71,81.75 69.71,81.12 68.17,79.58 v68.17,71.7 | v47.45,66.78 47.45,66.82 38.1,76.17 J13.4
EN5-A  (via drill 0.25)
  Top 0.152: v70.36,94.01 70.33,93.98 70.26,94.06 67.92,94.06 67.78,93.92 U1.47
  Route14 0.152: v69.09,59.87 68.48,59.26 68.48,59.21 36.92,59.21 J14.3
  Route15 0.152: v70.36,94.01 70.36,89.69 69.44,88.77 69.44,85.47 70.1,84.81 70.1,80.64 69.09,79.63 v69.09,59.87
EN5-B  (via drill 0.25)
  Top 0.152: v68.38,93.45 67.06,93.45 U1.46
  Route14 0.152: J14.4 37.65,57.94 54.56,57.94 54.91,57.58 66.47,57.58 v66.83,57.94
  Route15 0.152: v68.38,93.45 68.33,93.4 68.33,80.7 67.31,79.68 67.31,60 66.83,59.51 v66.83,57.94
EN6-A  (via drill 0.25)
  Top 0.152: U1.32 64.45,88.13 64.45,85.31 63.75,84.61 v63.6,84.61
  Route14 0.152: v63.93,37.74 63.88,37.69 36.79,37.69 35.4,39.08 J15.3
  Route15 0.152: v63.6,84.61 63.14,84.61 63.14,72.62 65.33,70.43 65.33,45.54 64.01,44.22 64.01,37.82 v63.93,37.74
EN6-B  (via drill 0.25)
  Top 0.152: U1.28 62.35,88.18 62.33,88.16 62.33,86.84 v62.23,86.84
  Route14 0.152: v63.02,40.44 38.7,40.44 J15.4
  Route15 0.152: v62.23,86.84 62.18,86.79 62.18,83.24 62.64,82.78 62.64,72.47 64.77,70.33 64.77,46 63.02,44.25 v63.02,40.44
EN7-A  (via drill 0.25)
  Top 0.152: U1.26 61.35,87.64 60.4,86.69 v60.4,86.54
  Route14 0.152: J16.3 36.6,19.28 v61.98,19.28
  Route15 0.152: v60.4,86.54 61.63,85.31 61.62,79.58 62.18,79.02 62.18,72.26 63.96,70.48 63.96,46.56 62.03,44.63 62.03,19.28 v61.98,19.28
EN7-B  (via drill 0.25)
  Top 0.152: U1.23 58.32,89.42 58.05,89.69 56.36,89.69 55.78,89.11 v55.78,87.81
  Route14 0.152: v60.96,20.65 60.85,20.54 J16.4
  Route15 0.152: v55.78,87.81 55.78,84.78 61.77,78.77 61.77,72.06 63.3,70.54 63.3,47.27 61.21,45.19 61.21,20.65 v60.96,20.65
EXTERNAL_CLK
  Top 0.152: U1.35 65.85,87.84 66.95,86.74 66.95,84.63 Y1.3
FLASH_CLK
  Top 0.152: U2.6 60.87,77.32 R10.1 58.05,77.63 SV1.4
  Route15 0.152: SV1.4 59.69,74.9 59.69,68.05 51.82,60.17 51.82,34.16 J8.1
FLASH_CS
  Top 0.152: U2.1 71.97,74.75 69.98,74.75 66.47,71.25 58.27,71.25 SV1.8 54.46,68.96 R29.1
  Route15 0.152: SV1.8 57.51,67.69 57.56,67.69 50.95,61.09 50.95,25.37 52.53,23.8 57.3,23.8 58.42,24.92 J8.2
FLASH_HOLD
  Top 0.152: R11.1 66.51,75.97 U2.7
FLASH_MISO
  Top 0.152: SV1.6 58.11,74.55 60.96,71.7 65.99,71.7 68,73.71 68,78.54 67.94,78.59 U2.5
  Route15 0.152: SV1.6 58.88,73.18 58.88,68.2 51.36,60.68 51.36,30.94 54.33,27.97 54.33,26.57 J8.4
FLASH_MOSI
  Top 0.152: U2.2 68.38,76.05 68.38,79.43 68.17,79.63 SV1.2
  Route15 0.152: SV1.2 59.99,77.14 59.99,64.92 61.49,63.42 61.49,50.11 61.52,50.09 61.52,46.35 60.3,45.14 60.3,27.66 58.83,26.19 57.05,26.19 55.88,27.36 J8.3
FLASH_WP
  Top 0.152: 73.61,81.46 72.99,81.46 R28.1
  Top 0.203: U2.3 73.63,77.32 73.66,77.29 73.66,81.41 73.61,81.46
FPGA_CDONE  (via drill 0.25, 0.35)
  Top 0.152: v62.92,97.13 62.92,96.17 63.35,95.73 U1.7 | IC3.34 61.65,122.93 61.65,121.36 61.45,121.15 v61.45,118.56 | R39.1 57.2,117.53 v58.22,118.54
  Route14 0.152: v58.22,118.54 58.24,118.56 v61.45,118.56
  Route15 0.152: v62.92,97.13 62.92,100.38 62.23,101.07 62.23,114.53 62.28,114.58 61.7,115.16 61.7,118.31 v61.45,118.56
FPGA_CLK  (via drill 0.25)
  Top 0.152: U1.18 59.37,91.92 59.31,91.97 58.57,91.97 58.52,92.02 58.44,91.94 v58.44,91.92 | v57.18,96.88 54.75,96.88 | 54.75,96.88 R13.2 | IC3.30 59.7,122.53 59.69,122.51 59.69,121.64 59.54,121.49 v59.54,120.17 | 54.75,96.88 53.26,96.88 53.14,97 53.14,103.76 53.19,103.81 v58.22,103.81
  Route15 0.152: v58.44,91.92 v58.44,91.93 57.15,93.21 57.15,96.95 57.18,96.93 v57.18,96.88 | v59.54,120.17 59.54,118.29 58.11,116.87 58.11,103.91 v58.22,103.81
FPGA_CRESET_B  (via drill 0.25)
  Top 0.152: IC3.33 61.2,121.49 60.76,121.06 v60.12,121.06 60.15,121.03 60.15,119.3 | U1.8 62.85,95.8 62.48,96.17 62.48,96.7 62.13,97.05 62.13,97.76 v62.18,97.82 | v61.21,114.63 60.15,114.63 60.15,119.3 | 60.15,119.3 R38.1 56.27,120.22 C67.1
  Route15 0.152: v62.18,97.82 61.72,98.27 61.72,114.22 61.32,114.63 v61.21,114.63
FPGA_CS  (via drill 0.25)
  Top 0.152: R12.2 62.11,100.7 62.18,100.76 63.19,100.76 v63.3,100.86 | v62.03,120.93 62.2,121.11 IC3.35 | U1.6 63.85,96.09 v63.55,96.39
  Route15 0.152: v62.03,120.93 62.23,120.73 62.23,115.49 62.94,114.78 62.94,101.22 v63.3,100.86 63.45,100.86 63.5,100.91 63.55,100.86 v63.55,96.39
FPGA_FLASH_CLK  (via drill 0.25)
  Top 0.152: v57.96,94.56 58.55,94.56 59.7,93.42 U1.15 | v57.76,97.66 55.66,97.66 R13.1
  Route14 0.152: v57.96,94.56 v55.02,94.56
  Route15 0.152: v57.96,94.56 57.76,94.77 v57.76,97.66 | v55.02,94.56 53.29,92.84 53.29,78.36 54.56,77.09 SV1.3
FPGA_FLASH_CS  (via drill 0.25)
  Top 0.152: v59.59,98.48 59.59,98.77 R12.1 | SV1.7 56.51,73.56 56.51,80.04 56.69,80.22 56.69,84.66 v56.72,84.68 | v58.48,93.57 59.13,92.92 U1.16 59.08,92.92 58.5,93.5 56.33,93.5 v56.11,93.72
  Route14 0.152: v57.68,98.5 59.56,98.5 v59.59,98.48
  Route15 0.152: v58.48,93.57 58.48,94.29 58.52,94.33 58.52,95.56 58.34,95.73 58.34,97.89 57.71,98.53 v57.68,98.5 | v56.11,93.72 56.11,93.4 55.68,92.97 55.68,88.9 56.69,87.89 56.69,84.71 v56.72,84.68
FPGA_FLASH_MISO
  Top 0.152: 58.55,95.21 59.91,93.86 60.1,93.86 U1.14 | 58.36,95.48 58.55,95.28 58.55,95.21 | R32.1 58.36,95.48 | 58.55,95.21 58.36,95.41 | 58.36,95.41 58.36,95.48 | 58.36,95.41 57,95.41 55.07,93.47 55.07,86.94 53.95,85.83 53.95,75.56 SV1.5
FPGA_FLASH_MOSI  (via drill 0.25)
  Top 0.152: U1.17 58.79,92.42 v58.47,92.74 | R33.1 54.39,92.21 v54.41,92.23
  Route14 0.152: v54.41,92.23 54.91,92.74 v58.47,92.74
  Route15 0.152: v54.41,92.23 53.8,91.62 53.8,80.8 SV1.1
FPGA_MISO  (via drill 0.25)
  Top 0.152: U1.19 v59.08,91.42 v59.08,91.41 | R32.2 56.66,100.72 56.69,100.76 v56.72,100.74 | IC3.31 60.2,124.33 59.94,124.59 v59.64,124.59
  Route15 0.152: v59.08,91.41 59.08,95.43 58.65,95.86 58.65,100.71 56.74,100.71 v56.72,100.74 57.19,101.21 57.19,125.4 58.83,125.4 v59.64,124.59
FPGA_MOSI  (via drill 0.25)
  Top 0.152: v60.5,121.84 60.7,122.04 IC3.32 | v54.51,90.55 54.46,90.5 54.44,90.51 R33.2 52.9,90.55 v51.26,90.55 | v58.95,90.53 59,90.53 59.11,90.42 U1.21
  Route14 0.152: v54.51,90.55 54.97,91.01 58.47,91.01 v58.95,90.53 | v51.16,117.63 60.43,117.63 v60.73,117.93
  Route15 0.152: v51.26,90.55 51.16,90.65 v51.16,117.63 | v60.73,117.93 60.81,118.01 60.81,121.54 v60.5,121.84
GND  (via drill 0.25, 0.35, 0.65)
  Top 0.152: C24.2 94.69,57.63 92,57.63 91.95,57.59 | 91.95,57.59 R17.1 | 91.95,57.59 91.95,58.2 v92.05,58.29 | C21.2 99.77,57.48 99.82,57.53 103.28,57.53 103.43,57.38 103.43,56.31 C22.2 | 55.13,45.75 C50.2 | IC3.74 v70.36,136.32 | R1.1 46.02,133.8 46.02,132.56 v45.97,132.51 | R2.1 43.69,132.51 v43.64,132.51 | R3.1 41.15,132.61 v41.12,132.59 | C44.2 v65.13,72.67 | J9.1 32.52,151.51 v40.44,151.51 | J10.1 32.52,133.22 39.32,133.22 39.83,133.73 v39.83,134.39 | J11.1 32.47,114.38 39.52,114.38 v40.33,115.19 | J12.1 32.62,95.99 40.39,95.99 40.49,96.09 v40.51,96.06 | J13.1 32.57,77.39 40.59,77.39 40.74,77.55 v40.82,77.47 | J14.1 32.57,58.85 40.28,58.85 42.16,60.73 v42.16,60.83 | J15.1 32.62,40.36 37.85,40.36 40.03,42.54 v40.03,42.85 | J16.1 32.52,21.72 40.94,21.72 v41.15,21.51 | v51.92,139.52 50.91,139.52 R34.1 | v42.72,122 | v44.86,121.03 44.86,121.99 U12.6 44.84,122.76 U12.5 | U6.4 96.47,96.64 U6.9 | U1.49 64.52,92.58 v64.54,92.58 | 86.34,140.5 86.41,140.57 | C65.2 v50.22,47.68 | C67.2 54.79,120.95 v54.79,121.72 | C66.2 59.36,56.91 | v50.23,122.82 v50.24,122.81 | U12.18 U12.17 U12.16 | v46.84,125.94
  Top 0.203: U4.4 95.49,14.57
  Top 0.254: 95.49,14.57 95.49,14.7 95.36,14.82 94.8,14.82 94.72,14.74 94.72,14.62 U4.9 | v59.54,139.98 C55.2 | v69.88,96.82 69.85,96.8 C43.2 | C41.2 v66.6,97.71 | C29.1 57.6,121.54 v56.59,121.54 | IC3.94 60.7,137.65 v60.81,137.54 | C47.2 61.12,85.72 v60.4,85.72 | C46.2 v57.86,86.74 | C45.2 61.17,84.61 v60.3,84.61 | v66.22,85.55 66.23,85.56 C42.2 | C48.2 57.35,91.51 v57.35,92.07 | C49.2 49.58,52.32 v49.56,52.35 | 55.78,51.43 v55.8,51.46 | v68.99,84.3 Y1.2 | v72.64,79.53 72,78.88 U2.4 | U8.2 55.65,54.72 | Y4.2 v52.83,131.39 | C38.1 v54.51,125.04 | C4.2 v47.65,135.86 | C54.1 54.25,136.58 v54.2,136.63 | C16.2 95.66,100.56 95.61,100.61 93.12,100.61 92.92,100.41 R8.1 91.74,99.69 v91.69,99.75 | C11.2 100.53,100.76 100.63,100.86 103.89,100.86 104.04,100.71 C12.2 | R31.1 92.56,123.4 R30.1 92.54,122.11 92.56,122.1 v92.56,121.95 | v86.41,134.39 86.34,134.46 JTAG.9 88.14,136.83 88.14,139.37 JTAG.5 86.34,140.5 | 86.41,140.57 JTAG.3 | IC3.99 58.2,137.53 v58.24,137.57 | C3.2 v47.6,133.32 | C1.2 50.6,127.69 v49.99,127.08 | v48.82,129.11 49.92,129.11 Y4.4 | C2.2 v47.56,130.34 v47.55,130.33 | IC3.27 58.2,124.17 v58.22,124.18 | v70.56,120.57 69.86,120.57 C53.1 | IC3.49 69.2,123.84 69.54,124.18 v69.52,124.18 | C20.1 73.6,135.76 v74.29,135.76 | R25.1 92.96,79.69 | U12.15 49.66,121.69 v50.24,121.69 | U12.16 v50.23,122.82 | C64.1 46.43,119.86 v45.57,119.86 | U12.2 44.21,124.32 v43.89,124.64 | C62.1 44.2,126.26 v43.48,126.26 | C61.1 44.33,127.33 v43.54,127.33 | U12.25 v46.84,125.94
  Top 0.305: IC3.20 57.7,127.34 v57.76,127.28 | U7.2 55.78,51.43 | v58.01,58.55 57.03,58.55 C52.2 | v55.65,55.73 55.65,54.72 | v59.36,55.93 59.36,56.91 | C63.1 v42.72,122
  Top 0.381: v58.7,53.09 C51.2 | v53.87,45.75 55.13,45.75
  Top 0.813: C36.2 101.45,25.53 101.4,25.58 v101.27,25.45 | C7.2 89,27.66 v88.95,27.61 | C35.2 104.14,80.14 v104.14,80.19 | 92.96,79.69 92.93,79.73 91.74,79.73 v91.74,79.63 | C37.2 91.74,68.5 91.69,68.55 v91.67,68.53 | v94.59,123.62 C6.2 | U9.1 93.01,117.61 93.01,116.41 v92.86,116.41 | C5.2 90.42,110.41 90.32,110.31 v90.22,110.41 | R27.1 90.69,38.89 v88.65,38.89
  other vias: 16,153.85 17.63,153.85 19.41,153.85 21.23,153.8 16,152.22 17.63,152.22 19.41,152.27 21.23,152.12 16.05,150.6 17.58,150.65 19.35,150.65 21.29,150.65 16.66,7.59 18.29,7.59 20.07,7.59 21.89,7.59 16.71,6.02 18.29,6.02 20.07,6.02 21.89,6.02 16.71,9.37 18.29,9.37 20.07,9.37 21.89,9.37 16.66,22.63 18.29,22.63 20.07,22.63 21.89,22.63 16.71,21.06 18.29,21.06 20.07,21.06 21.89,21.06 16.66,27.76 18.29,27.76 20.07,27.76 21.89,27.76 16.66,26.14 18.29,26.14 20.07,26.14 21.89,26.14 16.71,24.41 18.29,24.41 20.07,24.41 21.89,24.41 16.66,41.43 18.29,41.43 20.07,41.43 21.89,41.43 16.71,39.85 18.29,39.85 20.07,39.85 21.89,39.85 16.66,46.56 18.29,46.56 20.07,46.56 21.89,46.56 16.66,44.93 18.29,44.93 20.07,44.93 21.89,44.93 16.71,43.21 18.29,43.21 20.07,43.21 21.89,43.21 16.46,139.17 18.08,139.17 19.86,139.17 21.69,139.17 16.46,137.54 18.08,137.54 19.86,137.54 21.69,137.54 16.51,135.81 18.08,135.81 19.86,135.81 21.69,135.81 16.46,134.04 18.08,134.04 19.86,134.04 21.69,134.04 16.51,132.46 18.08,132.46 19.86,132.46 21.69,132.46 16.56,120.42 18.19,120.42 19.96,120.42 21.79,120.42 16.56,118.8 18.19,118.8 19.96,118.8 21.79,118.8 16.61,117.07 18.19,117.07 19.96,117.07 21.79,117.07 16.56,115.29 18.19,115.29 19.96,115.29 21.79,115.29 16.61,113.72 18.19,113.72 19.96,113.72 21.79,113.72 21.95,100.3 20.32,100.3 18.54,100.3 16.71,100.3 21.89,101.88 20.32,101.88 18.54,101.88 16.71,101.88 21.95,95.17 20.32,95.17 18.54,95.17 16.71,95.17 21.95,96.8 20.32,96.8 18.54,96.8 16.71,96.8 21.89,98.53 20.32,98.53 18.54,98.53 16.71,98.53 16.61,59.72 18.24,59.72 20.02,59.72 21.84,59.72 16.66,58.14 18.24,58.14 20.02,58.14 21.84,58.14 16.61,64.85 18.24,64.85 20.02,64.85 21.84,64.85 16.61,63.22 18.24,63.22 20.02,63.22 21.84,63.22 16.66,61.49 18.24,61.49 20.02,61.49 21.84,61.49 16.56,83.44 18.19,83.44 19.96,83.44 21.79,83.44 16.56,81.81 18.19,81.81 19.96,81.81 21.79,81.81 16.61,80.09 18.19,80.09 19.96,80.09 21.79,80.09 16.56,78.31 18.19,78.31 19.96,78.31 21.79,78.31 16.61,76.73 18.19,76.73 19.96,76.73 21.79,76.73 105.21,16.18 105.21,18.72 105.21,20.75 103.17,20.75 103.17,18.72 100.89,20.75 100.89,18.72 98.86,18.72 98.86,20.75 96.82,20.75 96.82,18.72 94.79,20.75 94.79,18.72 92.51,20.75 92.51,18.72 90.22,18.72 90.22,20.75 88.19,20.75 88.19,18.72 105.31,57.84 105.31,59.87 103.43,59.87 103.43,57.84 101.14,59.87 101.14,57.84 99.11,57.84 99.11,59.87 97.08,59.87 97.08,57.84 95.05,59.87 95.05,57.84 92.76,59.87 92.76,57.84 90.47,57.84 90.47,59.87 88.44,59.87 88.44,57.84 106.73,101.02 106.73,103.05 104.7,103.05 104.7,101.02 102.41,103.05 102.41,101.02 100.38,101.02 100.38,103.05 98.35,103.05 98.35,101.02 96.32,103.05 96.32,101.02 94.03,103.05 94.03,101.02 91.74,101.02 91.74,103.05 89.71,103.05 89.71,101.02 88.19,16.69 88.19,14.66 88.19,12.37 89.97,12.37 89.97,10.34 88.19,10.34 89.97,8.56 88.19,8.56 91.74,5 91.74,6.78 89.97,6.78 88.19,6.78 88.19,5 89.97,5 89.71,98.98 89.71,96.95 89.71,94.67 91.49,94.67 91.49,92.63 89.71,92.63 91.49,90.86 89.71,90.86 93.27,87.3 93.27,89.08 91.49,89.08 89.71,89.08 89.71,87.3 91.49,87.3 88.44,55.55 88.44,53.52 88.44,51.23 90.22,51.23 90.22,49.2 88.44,49.2 90.22,47.42 88.44,47.42 92,43.87 92,45.64 90.22,45.64 88.44,45.64 88.44,43.87 90.22,43.87 29.82,10.79 29.77,9.17 29.77,7.49 29.77,5.82 32.56,10.74 32.61,9.22 32.56,7.49 32.61,5.82 34.34,10.74 36.22,10.69 36.17,9.07 34.34,9.22 34.39,7.54 36.17,7.44 36.17,5.77 34.44,5.77 30.07,29.24 30.02,27.61 30.02,25.93 30.02,24.26 32.82,29.18 32.87,27.66 32.82,25.93 32.87,24.26 34.59,29.18 36.47,29.13 36.42,27.51 34.59,27.66 34.65,25.98 36.42,25.88 36.42,24.21 34.7,24.21 30.12,47.88 30.07,46.25 30.07,44.58 30.07,42.9 32.87,47.83 32.92,46.3 32.87,44.58 32.92,42.9 34.65,47.83 36.53,47.78 36.53,46.15 34.65,46.3 34.7,44.63 36.47,44.53 36.47,42.85 34.75,42.85 30.18,66.42 30.12,64.8 30.12,63.12 30.12,61.44 32.92,66.37 32.97,64.85 32.92,63.12 32.97,61.44 34.7,66.37 36.58,66.32 36.53,64.69 34.7,64.85 34.75,63.17 36.53,63.07 36.53,61.39 34.8,61.39 30.07,84.81 30.02,83.19 30.02,81.51 30.02,79.83 32.82,84.76 32.87,83.24 32.82,81.51 32.87,79.83 34.59,84.76 36.47,84.71 36.42,83.08 34.59,83.24 34.65,81.56 36.42,81.46 36.42,79.78 34.7,79.78 30.18,103.3 30.12,101.68 30.12,100 30.12,98.32 32.92,103.25 32.97,101.73 32.92,100 32.97,98.32 34.7,103.25 36.58,103.2 36.53,101.57 34.7,101.73 34.75,100.05 36.53,99.95 36.53,98.27 34.8,98.27 30.07,121.84 30.02,120.22 30.02,118.54 30.02,116.87 32.82,121.79 32.87,120.27 32.82,118.54 32.87,116.87 34.59,121.79 36.47,121.74 36.42,120.12 34.59,120.27 34.65,118.59 36.42,118.49 36.42,116.81 34.7,116.81 30.12,140.54 30.07,138.91 30.07,137.24 30.07,135.56 32.87,140.49 32.92,138.96 32.87,137.24 32.92,135.56 34.65,140.49 36.53,140.44 36.47,138.81 34.65,138.96 34.7,137.29 36.47,137.19 36.47,135.51 34.75,135.51 62.48,92.58 62.56,90.53 64.54,90.53
  pour Route2 (no thermals): 39.07,154.66 81.81,154.66 81.81,4.04 39.07,4.04
  pour Top (rank 3, no thermals): 15.54,140.89 22.91,140.89 22.91,130.48 15.54,130.48
  pour Top (rank 3, no thermals): 15.54,122.35 22.91,122.35 22.91,111.94 15.54,111.94
  pour Top (rank 3, no thermals): 15.54,103.81 22.91,103.81 22.91,93.4 15.54,93.4
  pour Top (rank 3, no thermals): 15.54,85.27 22.91,85.27 22.91,74.85 15.54,74.85
  pour Top (rank 3, no thermals): 15.54,66.73 22.91,66.73 22.91,56.31 15.54,56.31
  pour Top (rank 3, no thermals): 15.54,48.18 22.91,48.18 22.91,37.77 15.54,37.77
  pour Top (rank 3, no thermals): 15.54,29.64 22.91,29.64 22.91,19.23 15.54,19.23
  pour Top (isolate 0.254, rank 3, no thermals): 15.29,154.36 22.4,154.36 22.4,149.02 15.29,149.02
  pour Top (isolate 0.254, rank 3, no thermals): 15.8,11.1 22.91,11.1 22.91,5.31 15.8,5.31
  pour Top (isolate 0.254, rank 5, no thermals): 90.07,6.83 90.07,12.27 93.27,12.27 94.03,13.03 94.03,15.88 95.61,15.88 95.61,12.32 93.17,9.88 92.1,9.88 92.1,6.73 90.12,6.83 90.12,6.88
  pour Top (isolate 0.254, rank 5, no thermals): 90.98,45.64 90.98,51.08 94.18,51.08 94.95,51.84 94.95,54.69 96.52,54.69 96.52,51.13 94.08,48.69 93.01,48.69 93.01,45.54 91.03,45.64 91.03,45.69
  pour Top (isolate 0.254, rank 5, no thermals): 91.8,88.93 91.8,94.36 95,94.36 95.76,95.12 95.76,97.97 97.33,97.97 97.33,94.41 94.89,91.97 93.83,91.97 93.83,88.82 91.85,88.92 91.85,88.98
  pour Top (rank 5, no thermals): 106.48,16.69 106.48,21.77 86.16,21.77 86.16,3.73 92.25,3.73 92.51,3.99 92.51,14.91 92.76,15.16 106.48,15.16
  pour Top (rank 5, no thermals): 106.07,53.98 106.07,60.58 86.66,60.63 86.66,42.6 93.52,42.6 93.27,54.03
  pour Top (rank 5, no thermals): 108.25,98.98 108.25,104.06 87.93,104.06 87.93,86.03 94.03,86.03 94.28,86.28 94.28,97.21 94.54,97.46 108.25,97.46
  pour Route2 (no thermals): 95.45,132.72 78.89,132.72 78.49,133.12 78.49,154.76 95.45,154.76
  pour Route2 (no thermals): 1.9,18.82 115.77,18.87 115.77,3.84 1.98,3.84 1.83,3.99 1.88,18.82
  pour Route2 (no thermals): 37.03,154.71 1.88,154.71 1.88,4.7 2.54,4.04 36.78,4.04 37.03,4.29
  pour Route2 (no thermals): 117.09,3.78 84.12,3.78 84.02,3.89 84.02,129.97 83.97,130.02 97.49,130.02 97.69,130.23 97.69,154.76 117.2,154.76 117.3,154.66 117.3,3.78 117.2,3.78
  pour Top (no thermals): 27.94,11.2 37.03,11.2 37.08,11.15 37.08,3.84 27.99,3.84 27.94,3.89
  pour Top (no thermals): 28.19,29.69 37.29,29.69 37.34,29.64 37.34,22.33 28.24,22.33 28.19,22.38
  pour Top (no thermals): 28.14,48.34 37.24,48.34 37.29,48.29 37.29,40.97 28.19,40.97 28.14,41.02
  pour Top (no thermals): 28.14,66.83 37.24,66.83 37.29,66.78 37.29,59.46 28.19,59.46 28.14,59.51
  pour Top (no thermals): 28.19,85.37 37.29,85.37 37.34,85.32 37.34,78 28.24,78 28.19,78.05
  pour Top (no thermals): 28.14,103.91 37.24,103.91 37.29,103.86 37.29,96.55 28.19,96.55 28.14,96.6
  pour Top (no thermals): 28.09,122.45 37.19,122.45 37.24,122.4 37.24,115.09 28.14,115.09 28.09,115.14
  pour Top (no thermals): 28.04,141.1 37.13,141.1 37.19,141.05 37.19,133.73 28.09,133.73 28.04,133.78
GYRO_RESET  (via drill 0.35)
  Top 0.152: IC3.93 61.11,138.78 61.11,139.96 v61.13,139.98 | v47.35,120.37 U12.11
  Route15 0.152: v61.13,139.98 61.47,139.64 61.47,126.82 61.06,126.42 53.29,126.42 52.68,125.81 52.68,120.42 47.35,120.42 v47.35,120.37
I2C1_SCL  (via drill 0.35)
  Top 0.152: U12.19 49.42,124.34 R35.1 51.37,124.34 52.07,125.04 v52.07,126.42 | IC3.95 60.15,138.63 60.15,136.38 v59.99,136.22
  Route15 0.152: v59.99,136.22 59.89,136.22 59.89,128.24 59.74,128.09 53.09,128.09 52.07,127.07 v52.07,126.42
I2C1_SDA  (via drill 0.35)
  Top 0.152: U12.20 49.34,126.19 R36.1 49.22,127.33 47.75,128.79 v47.75,129.29 | IC3.96 59.7,137.81 59.03,137.13 v59.03,136.12
  Route15 0.152: v59.03,136.12 59.03,129.74 58.96,129.67 48.16,129.67 47.78,129.29 v47.75,129.29
INT  (via drill 0.35)
  Top 0.152: v62.08,136.88 61.67,137.29 61.67,138.66 IC3.92 | U12.14 48.81,121.98 48.81,120.93 53.19,120.93 v53.64,121.39
  Route15 0.152: v62.08,136.88 62.08,126.26 61.67,125.86 53.7,125.86 53.7,121.44 v53.64,121.39
JTAG_RESET  (via drill 0.25)
  Top 0.152: IC3.14 57.45,130.34 57.45,130.33 v57.51,130.38 | v90.27,135.2 90.27,136.8 JTAG.10
  Route14 0.152: v57.51,130.38 57.51,134.7 57.56,134.75 74.32,134.75 74.93,135.36 90.27,135.36 v90.27,135.2
JTAG_SWDCLK  (via drill 0.25)
  Top 0.152: IC3.76 70.64,139.62 v71.02,139.62 | v92.2,139.67 92.2,140.54 91.21,140.54 91.11,140.64 JTAG.4
  Route14 0.152: v92.2,139.67 71.07,139.67 v71.02,139.62
JTAG_SWDIO  (via drill 0.25)
  Top 0.152: IC3.72 71.43,135.46 69.57,135.46 69.57,137.39 70.31,137.39 v70.87,137.95 | v92.33,141.83 90.32,141.83 JTAG.2
  Route14 0.152: v70.87,137.95 71.12,137.69 93.17,137.69 93.17,141.66 92.99,141.83 v92.33,141.83
LED1
  Top 0.152: IC3.88 63.7,139.91 62.03,141.58 43.46,141.58 41.31,139.43 D1.A
LED2
  Top 0.152: IC3.89 63.2,139.75 61.81,141.15 45.5,141.15 D2.A
LED3
  Top 0.152: IC3.90 62.7,139.45 61.41,140.74 47.33,140.74 D3.A
M0_A  (via drill 0.25)
  Top 0.152: M0.3 13.74,146.86 v13.41,146.53 | v81.43,130.28 80.01,130.28 79.57,129.84 IC3.61
  Route14 0.152: v13.41,146.53 14.43,147.55 39.17,147.55 42.47,144.25 81.38,144.25 v81.38,144.3
  Route15 0.152: v81.38,144.3 81.38,130.33 v81.43,130.28
M0_B  (via drill 0.25)
  Top 0.152: M0.6 13.79,143.05 13.41,143.43 v13.39,143.41 | v80.37,131.29 79.4,130.33 71.56,130.33 IC3.62
  Route14 0.152: v80.42,143.28 78.74,143.28 77.9,142.44 30.61,142.44 29.64,143.41 v13.39,143.41
  Route15 0.152: v80.42,143.28 80.42,131.29 v80.37,131.29
M0_PWM  (via drill 0.25)
  Top 0.152: M0.11 28.47,143.05 v29.59,141.93 | v79.45,131.65 78.49,130.68 72.42,130.68 72.26,130.84 IC3.63
  Route14 0.152: v79.55,142.32 79.15,141.91 29.72,141.91 29.69,141.93 v29.59,141.93
  Route15 0.152: v79.55,142.32 79.55,131.75 v79.45,131.65
M1_A  (via drill 0.25)
  Top 0.152: M1.3 13.39,128.32 v13.16,128.09 | v79.4,128.55 79.15,128.8 71.58,128.8 IC3.59
  Route14 0.152: v13.16,128.09 14.17,129.11 41.25,129.11 42.01,128.35 65.64,128.35 67.89,126.1 79.36,126.1 v79.51,125.95
  Route15 0.152: v79.51,125.95 79.51,128.44 v79.4,128.55
M1_B  (via drill 0.25)
  Top 0.152: M1.6 15.91,124.51 15.56,124.87 13.18,124.87 v13.21,124.89 | v80.87,129.21 80.75,129.34 IC3.60
  Route14 0.152: v78.38,125.35 76.3,123.27 55.3,123.27 52.98,125.59 48.31,125.6 47.35,126.57 46.28,126.57 45.3,125.59 42.55,125.59 40.23,123.27 29.06,123.27 27.43,124.89 v13.21,124.89
  Route15 0.152: v78.38,125.35 78.23,125.5 78.23,129.21 v80.87,129.21
M1_PWM  (via drill 0.25)
  Top 0.152: M1.11 22.19,124.15 29.74,124.15 v29.95,123.95 | IC3.64 71.56,131.34 73.61,131.34 v73.71,131.24
  Route14 0.152: v29.95,123.95 39.14,123.95 40.88,125.69 43.08,127.94 59.69,127.94 61.98,125.65 73.3,125.65 v73.71,125.25
  Route15 0.152: v73.71,125.25 v73.71,131.24
M2_A  (via drill 0.25)
  Top 0.152: M2.3 16.7,109.6 12.8,109.6 v12.8,109.55 | v77.83,132.71 74.96,132.71 74.75,132.92 71.64,132.92 IC3.67
  Route14 0.152: v12.8,109.55 13.92,109.55 14.88,110.52 41.12,110.52 42.3,111.7 76.85,111.7 76.93,111.79 77.77,111.79 v77.83,111.84
  Route15 0.152: v77.83,111.84 v77.83,132.71
M2_B  (via drill 0.25)
  Top 0.152: M2.6 16.55,106.3 12.8,106.3 12.75,106.35 v12.75,106.65 | v76.91,133.32 72.59,133.32 72.58,133.34 IC3.68
  Route14 0.152: v12.75,106.65 27.89,106.65 29.11,105.44 41.76,105.44 43.33,107.01 43.31,107.04 43.31,110.29 43.99,110.97 76.91,110.97 v77.16,111.23
  Route15 0.152: v76.91,133.32 77.16,133.07 v77.16,111.23
M2_PWM  (via drill 0.25)
  Top 0.152: M2.11 27.15,105.97 v28.35,104.77 | v76.35,131.9 74.45,131.9 74.35,131.8 73.89,131.8 73.85,131.84 IC3.65
  Route14 0.152: v28.35,104.77 41.91,104.77 44.2,107.06 44.2,110.11 76.5,110.11 v76.56,110.16
  Route15 0.152: v76.35,131.9 76.45,131.8 76.45,110.26 v76.56,110.16
M3_A  (via drill 0.25)
  Top 0.152: M3.3 13.84,91.24 13.36,90.75 v13.41,90.7 | v75.62,133.91 75.52,133.82 71.57,133.82 IC3.69
  Route14 0.152: v13.41,90.7 14.43,91.72 44.91,91.72 44.93,91.69 v45.08,91.69 | v75.51,119.48 75.31,119.28 47.37,119.28 v46.56,118.47
  Route15 0.152: v45.08,91.69 45.08,117.35 46.2,118.47 v46.56,118.47 | v75.51,119.48 75.62,119.58 v75.62,133.91
M3_B  (via drill 0.25)
  Top 0.152: M3.6 13.94,87.43 13.51,87.86 v13.46,87.81 | v74.93,134.49 74.78,134.34 IC3.70
  Route14 0.152: v13.46,87.81 28.5,87.81 29.26,87.05 44.81,87.05 45.87,88.11 v45.87,88.37 | v75.23,108.43 75.08,108.28 46.08,108.28 v46.02,108.23
  Route15 0.152: v45.87,88.37 45.87,108.13 46,108.25 v46.02,108.23 | v74.93,134.49 74.83,134.39 74.83,108.84 v75.23,108.43
M3_PWM  (via drill 0.25)
  Top 0.152: M3.11 21.91,87.35 27.79,87.35 v28.8,86.33 | v74.12,132.36 71.58,132.36 IC3.66
  Route14 0.152: v28.8,86.33 45.31,86.33 v46.48,87.5 | v74.07,107.47 74.12,107.47 73.96,107.31 v46.53,107.31
  Route15 0.152: v46.48,87.5 46.48,107.26 v46.53,107.31 | v74.07,107.47 74.32,107.72 74.32,132.26 74.17,132.41 v74.12,132.36
M4_A  (via drill 0.25)
  Top 0.152: M4.3 16.55,72.36 12.29,72.36 v12.19,72.26 | v60.96,116.81 63.4,116.81 63.4,121 63.17,121.23 63.17,122.95 IC3.37
  Route14 0.152: v12.19,72.26 13.16,73.23 47.09,73.23 v47.14,73.18 | v60.96,116.81 60.71,117.07 47.35,117.07 v47.29,117.12
  Route15 0.152: v47.14,73.18 47.19,73.23 47.19,117.12 v47.29,117.12
M4_B  (via drill 0.25)
  Top 0.152: M4.6 12.52,68.88 12.14,69.27 v12.22,69.34 | IC3.36 62.67,122.95 62.67,122.27 62.74,122.21 62.74,120.75 v62.84,120.65
  Route14 0.152: v12.22,69.34 29.13,69.34 30.2,68.27 47.37,68.27 47.95,68.86 47.95,69.21 v48.01,69.27 | v62.84,116 62.79,116.05 48.06,116.05 v47.95,116.15
  Route15 0.152: v48.01,69.27 48.01,69.52 48.11,69.62 48.11,114.93 48.06,114.99 48.06,116.05 v47.95,116.15 | v62.84,120.65 62.89,120.6 62.89,116.05 v62.84,116
M4_PWM  (via drill 0.25)
  Top 0.152: M4.11 27.79,68.88 v29.06,67.61 | IC3.40 64.7,115.22 v64.67,115.19
  Route14 0.152: v48.72,67.69 48.64,67.61 v29.06,67.61 | v49.02,115.34 64.52,115.34 v64.67,115.19
  Route15 0.152: v48.72,67.69 49.07,68.05 49.07,115.29 v49.02,115.34
M5_A  (via drill 0.25)
  Top 0.152: M5.3 16.55,53.82 13.56,53.82 v13.56,53.97 | IC3.39 64.3,122.88 64.3,120.82 v64.06,120.57
  Route14 0.152: v13.56,53.97 14.33,54.74 49.17,54.74 v49.38,54.94 | v49.68,105.99 64.16,105.99 64.26,106.1 v64.29,106.07
  Route15 0.152: v49.68,105.99 49.68,55.4 49.38,55.09 v49.38,54.94 | v64.29,106.07 63.93,106.43 63.93,120.45 v64.06,120.57
M5_B  (via drill 0.25)
  Top 0.152: M5.6 14.05,50.34 13.72,50.67 v13.66,50.62 | v63.73,121.67 63.7,121.69 IC3.38
  Route14 0.152: v13.66,50.62 13.97,50.93 28.88,50.93 30,49.81 49.22,49.81 49.22,49.86 v50.39,51.03 | v50.47,105.21 63.37,105.21 63.55,105.38 63.6,105.38 v63.65,105.33
  Route15 0.152: v50.39,51.03 50.39,51.54 50.44,51.59 50.44,105.21 v50.47,105.21 | v63.65,105.33 63.45,105.54 63.45,121.44 63.7,121.69 v63.73,121.67
M5_PWM  (via drill 0.25)
  Top 0.152: v28.57,49.68 27.97,50.29 21.88,50.29 M5.11 | v66.29,115.6 65.7,116.19 IC3.42
  Route14 0.152: v28.57,49.68 28.93,49.33 61.34,49.33 62.71,50.7 v62.71,50.8 | v66.6,103 66.55,102.95 56.49,102.95 v56.29,102.74
  Route15 0.152: v62.71,50.8 62.76,50.75 62.76,70.43 61.39,71.81 61.39,78.62 55.77,84.26 | 55.77,84.26 | v56.29,102.74 56.08,102.54 56.08,96.6 56.06,96.57 56.06,94.46 55.22,93.62 55.22,84.81 55.77,84.26 | v66.6,103 66.6,115.6 v66.29,115.6
M6_A  (via drill 0.25)
  Top 0.152: M6.3 16.6,35.33 13.51,35.33 13.46,35.38 v13.46,35.43 | v72.85,116.2 66.5,116.2 66.2,116.5 IC3.43
  Route14 0.152: v13.46,35.43 14.22,36.19 v71.88,36.19
  Route15 0.152: v71.88,36.19 71.88,57.78 73.3,59.21 73.3,79.76 72.8,80.27 72.8,116.2 v72.85,116.2
M6_B  (via drill 0.25)
  Top 0.152: M6.6 13.94,31.8 13.56,32.18 v13.59,32.21 | v73.46,114.78 73.56,114.88 65.99,114.88 65.33,115.54 65.33,121.69 65.18,121.84 65.18,122.91 65.23,122.96 IC3.41
  Route14 0.152: v71.53,32.49 68.73,32.49 67.31,31.06 31.09,31.06 29.64,32.51 13.89,32.51 v13.59,32.21
  Route15 0.152: v71.53,32.49 72.69,33.65 72.69,57.61 74.02,58.94 74.02,80.04 73.41,80.64 73.41,114.78 v73.46,114.78
M6_PWM  (via drill 0.25)
  Top 0.152: M6.11 28.02,31.8 28.14,31.67 v28.24,31.67 | v72.08,117.02 66.57,117.02 66.57,122.12 66.75,122.3 66.75,122.45 66.75,122.46 66.75,122.93 IC3.44
  Route14 0.152: v70.97,31.37 69.85,30.25 29.67,30.25 v28.24,31.67
  Route15 0.152: v70.97,31.37 70.92,31.42 70.92,57.78 72.03,58.9 72.03,116.97 v72.08,117.02
M7_A  (via drill 0.25)
  Top 0.152: M7.3 16.6,16.79 13.36,16.79 v13.36,16.69 | v71.4,118.57 68.5,118.57 68.2,118.87 IC3.47
  Route14 0.152: v13.36,16.69 27.03,16.69 29.67,19.33 29.67,21.31 30.84,22.48 69.9,22.48 v70.36,22.94
  Route15 0.152: v70.36,22.94 70.26,23.04 70.26,58.09 71.5,59.33 71.5,118.47 v71.4,118.57
M7_B  (via drill 0.25)
  Top 0.152: M7.6 13.59,13.26 13.31,13.54 v13.36,13.59 | v70.79,117.8 68.55,117.8 67.72,118.64 67.72,122.97 IC3.46
  Route14 0.152: v13.36,13.59 13.92,13.03 40.87,13.03 46.1,18.26 67.56,18.26 68.36,19.06 68.42,19.06 v68.48,19.13
  Route15 0.152: v68.48,19.13 69.65,20.29 69.65,58.21 70.92,59.48 70.92,117.68 v70.79,117.8
M7_PWM  (via drill 0.25)
  Top 0.152: M7.11 21.88,13.21 28.22,13.21 v29.13,12.29 | v67.13,120.34 67.2,120.42 IC3.45
  Route14 0.152: v29.13,12.29 29.18,12.34 42.01,12.34 v42.01,12.32
  Route15 0.152: v67.13,120.34 67.11,120.32 67.16,120.27 67.16,98.65 67.77,98.04 67.77,81 66.7,79.93 66.7,60.32 66.14,59.77 66.14,20.85 62.89,17.6 47.29,17.6 v42.01,12.32
N$1
  Top 0.152: D3.C 46.13,135.6 R1.2
N$2
  Top 0.152: D2.C 43.79,135.65 R2.2
N$3
  Top 0.152: D1.C 41.3,135.8 R3.2
N$4
  Top 0.203: U6.2 97.2,95.84 97.57,95.84 97.94,95.48 97.94,94.25 98.55,93.64 C14.2
N$5
  Top 0.152: R34.2 50.87,137.78 D4.C
N$6
  Top 0.152: R37.2 43.8,123.32 U12.4
N$7
  Top 0.152: C49.1 52.93,52.31 | 52.93,52.31 52.93,52.2 52.93,51.45 54.17,50.22 U7.3 | R40.1 52.93,54.18 52.93,52.31
N$8
  Top 0.254: U1.29 62.85,86.13 C47.1 C45.1 62.22,83.62 R4.1
N$9
  Top 0.152: 46.34,120.68 C64.2
  Top 0.254: U12.9 46.34,120.68
N$10
  Top 0.152: U8.4 56.31,56.95
  Top 0.305: 56.31,56.95 C66.1
N$11
  Top 0.152: C65.1 54.78,47.68 U7.4
N$12
  Top 0.152: R41.1 J17.24
N$13
  Top 0.203: U6.5 95.49,96.79 95.49,98.02 C16.1
N$14  (via drill 0.35)
  Top 0.203: R6.1 91.08,96.65 91.13,96.6 v91.08,96.55 92.21,96.55 C13.1
  Bottom 0.203: R5.1 92.92,98.53 91.08,96.69 v91.08,96.55
N$15
  Top 0.203: R7.1 91.13,98.27 R6.2
N$16  (via drill 0.35)
  Top 0.203: R8.2 R7.2 93.82,96.86 C13.2 | U6.6 95.09,96.24 94.53,96.8 C13.2 | C13.2 94.44,96.8 94.49,96.75 94.59,96.75 v94.64,96.8
  Bottom 0.203: R9.2 95.86,96.8 v94.64,96.8
N$17
  Top 0.203: C17.1 93.59,95.84 U6.7
N$18  (via drill 0.35)
  Top 0.152: v98.3,96.19 97.84,96.19 97.79,96.24
  Top 0.203: U6.3 97.79,96.24
  Bottom 0.203: v98.3,96.19 97.59,96.9 R9.1
  pour Top (isolate 0.254, rank 2, no thermals): 98.25,95.17 98.25,94.41 99.31,93.34 99.31,92.08 97.85,92.08 97.89,90.6 97.89,90.25 101.75,90.25 101.75,93.95 100.53,95.17
  pour Top (isolate 0.254, rank 3, no thermals): 97.66,96.7 98.65,96.7 98.65,94.77 97.66,95.76
N$19
  Top 0.152: R42.1 J17.26
N$20
  Top 0.152: U3.2
  Top 0.203: U3.2 96.62,52.6 97.08,52.15 97.08,50.56
  Top 0.254: 97.08,50.56 C18.2
N$21  (via drill 0.35)
  Top 0.152: C23.1 91.25,53.31 v90.12,53.31
  Top 0.203: R15.1 90.17,53.31 v90.12,53.31
  Bottom 0.203: v90.12,53.31 90.12,53.67 91.69,55.24 R14.1
N$22
  Top 0.152: U5.4 89.29,126.39 Q2.1 90.41,127.24 90.47,127.18 90.47,126.07 R31.2
N$23
  Top 0.152: R30.2 88.85,123.42 88.55,123.73 U5.3 U5.2 U5.1
N$24
  Top 0.203: R15.2 91.91,55.09 R16.1
N$25  (via drill 0.35)
  Top 0.203: U3.3 96.92,53.01
  Top 0.254: 96.92,53.01 96.93,53.01
  Bottom 0.203: v97.43,52.96 97.43,53.06 97.38,53.06 96.77,53.67 R18.1
  pour Top (isolate 0.254, rank 2, no thermals): 97.54,51.84 97.54,51.33 98.55,50.32 98.55,49.1 96.85,49.1 96.92,46.86 100.79,46.86 100.79,50.62 99.57,51.84
  pour Top (isolate 0.254, rank 3, no thermals): 96.85,53.37 97.84,53.37 97.84,51.44 96.85,52.43
N$26
  Top 0.203: U3.5 94.68,54.94 C24.1
N$27
  Top 0.203: C25.1 92.62,52.6 94.53,52.6 94.54,52.61 U3.7
N$28  (via drill 0.35)
  Top 0.203: R17.2 R16.2 92.86,53.62 C23.2 | U3.6 94.14,53.01 93.57,53.57 C23.2 | C23.2 v93.72,53.57
  Bottom 0.203: R18.2 93.82,53.67 v93.72,53.57
N$29
  Top 0.203: U4.2 95.91,13.74 96.21,13.44 96.21,11.91 96.72,11.4 C27.2
N$30  (via drill 0.35)
  Top 0.203: C32.1 90.48,14.45 v89.41,14.45 R20.1
  Bottom 0.203: R19.1 91.03,16.33 89.41,14.71 v89.41,14.45
N$31
  Top 0.203: R20.2 91.15,16.23 R21.1
N$32  (via drill 0.35)
  Top 0.203: U4.3 96.08,14.15 v96.62,14.15 96.82,13.94 | 98.2,8.56 98.4,8.56 98.2,8.76 98.2,8.56 | C27.1 96.72,8.56 98.2,8.56
  Bottom 0.203: R23.1 96.01,14.71 96.57,14.15 v96.62,14.15
  pour Top (isolate 0.254, rank 2, no thermals): 96.11,12.73 96.11,8 99.97,8 99.97,12.12 99.36,12.73
  pour Top (isolate 0.254, rank 3, no thermals): 96.14,14.6 97.08,14.6 97.08,11.76 96.14,12.7
N$33